# EAGLE design SensorMux_v1.0 (EAGLE 8.6.3)

## Sheet 1 of 6
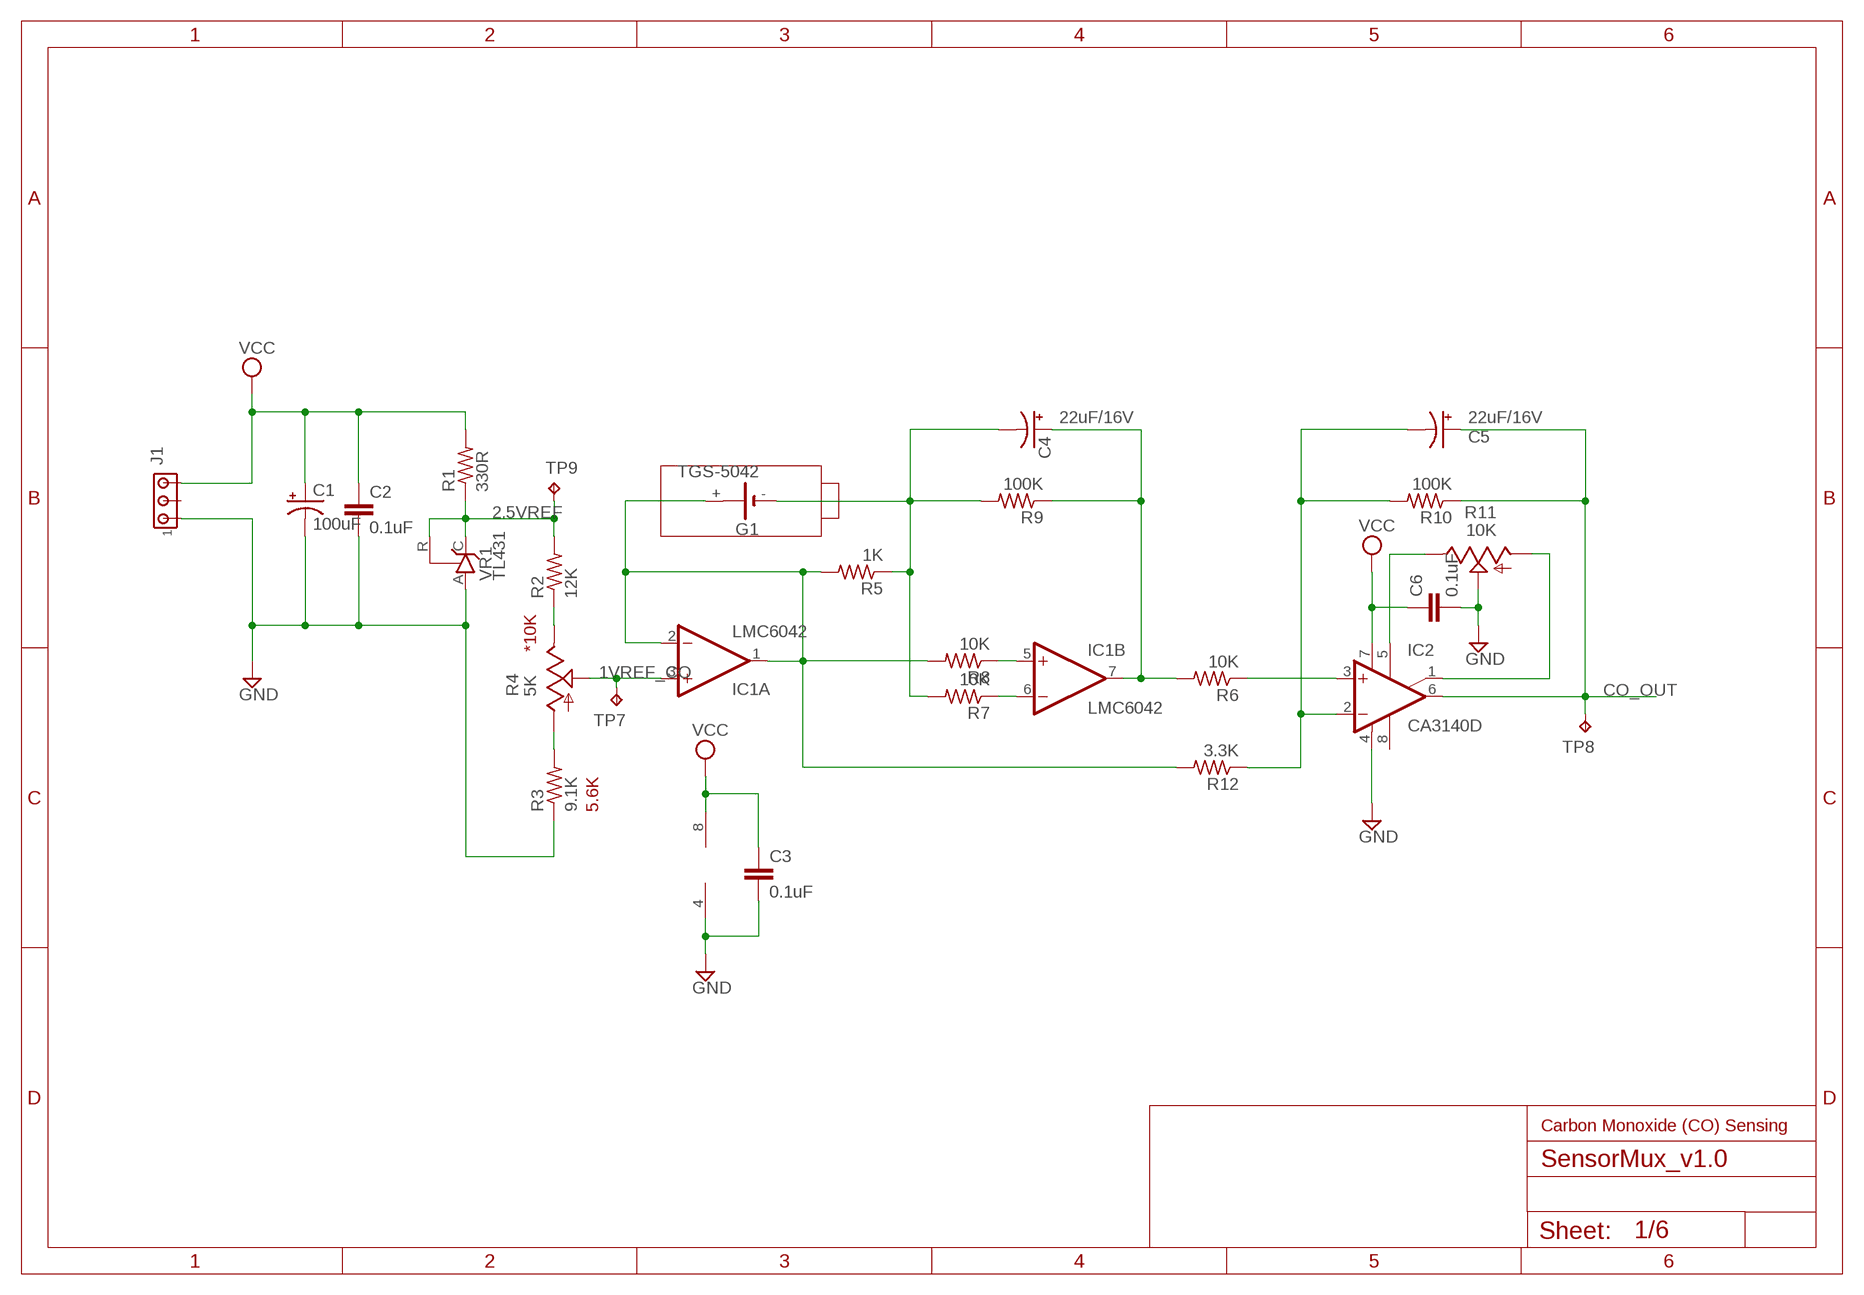
[diagram p0: schematic, sheet 1]

### Parts
C1  100uF  CPOL-USE5-6  [E5-6]
C2  0.1uF  C-EUC0603K  [C0603K]
C3  0.1uF  C-EUC0603K  [C0603K]
C4  22uF/16V  CPOL-USE2.5-6  [E2,5-6]
C5  22uF/16V  CPOL-USE2.5-6  [E2,5-6]
C6  0.1uF  C-EUC0603K  [C0603K]
G1  TGS-5042  CR-AA  [CRAA]
IC1  LMC6042  LM358D  [SO08]
IC2  CA3140D  [SO08]
J1  MTA03-100  [10X03MTA]
R1  330R  R-US_R0805  [R0805]
R2  12K  R-US_R0805  [R0805]
R3  9.1K  R-US_R0805  [R0805]
R4  5K  TRIM_US-B64Y  [B64Y]
R5  1K  R-US_R0805  [R0805]
R6  10K  R-US_R0805  [R0805]
R7  10K  R-US_R0805  [R0805]
R8  10K  R-US_R0805  [R0805]
R9  100K  R-US_R0805  [R0805]
R10  100K  R-US_R0805  [R0805]
R11  10K  TRIM_US-B64Y  [B64Y]
R12  3.3K  R-US_R0805  [R0805]
TP7  1V  TPTP08R  [TP08R]
TP8  CO  TPTP08R  [TP08R]
TP9  2.5V  TPTP08R  [TP08R]
VR1  TL431  TL431CLP  [TO92-CLP]

### Nets
1VREF_CO: IC1.3(A:+IN) R4.S TP7.TP
2.5VREF: R1.1 R2.2 TP9.TP VR1.C VR1.R ; also sheet 3,4
CO_OUT: C5.+ IC2.6(OUT) R10.1 TP8.TP ; also sheet 6
GND: C1.- C2.2 C3.2 C6.2 IC1.4(P:V-) IC2.4(V-) J1.1 R3.1 R11.S VR1.A ; also sheet 2,3,4,5,6
N$1: G1.+ IC1.1(A:OUT) IC1.2(A:-IN) R5.2 R8.2 R12.2
N$3: IC1.6(B:-IN) R7.1
N$4: C4.- G1.- R5.1 R7.2 R9.2
N$6: IC1.5(B:+IN) R8.1
N$9: R2.1 R4.E
N$10: R3.2 R4.A
N$13: C4.+ IC1.7(B:OUT) R6.2 R9.1
N$14: IC2.3(+IN) R6.1
N$15: C5.- IC2.2(-IN) R10.2 R12.1
N$18: IC2.5(ON) R11.E
N$19: IC2.1(ON/CMP) R11.A
VCC: C1.+ C2.1 C3.1 C6.1 IC1.8(P:V+) IC2.7(V+) J1.3 R1.2 ; also sheet 2,3,4,5,6
Unconnected: G1.+@1(+) IC2.8(CMP) J1.2

### Notes on the sheet
- *10K
- 5.6K
- Carbon Monoxide (CO) Sensing

## Sheet 2 of 6
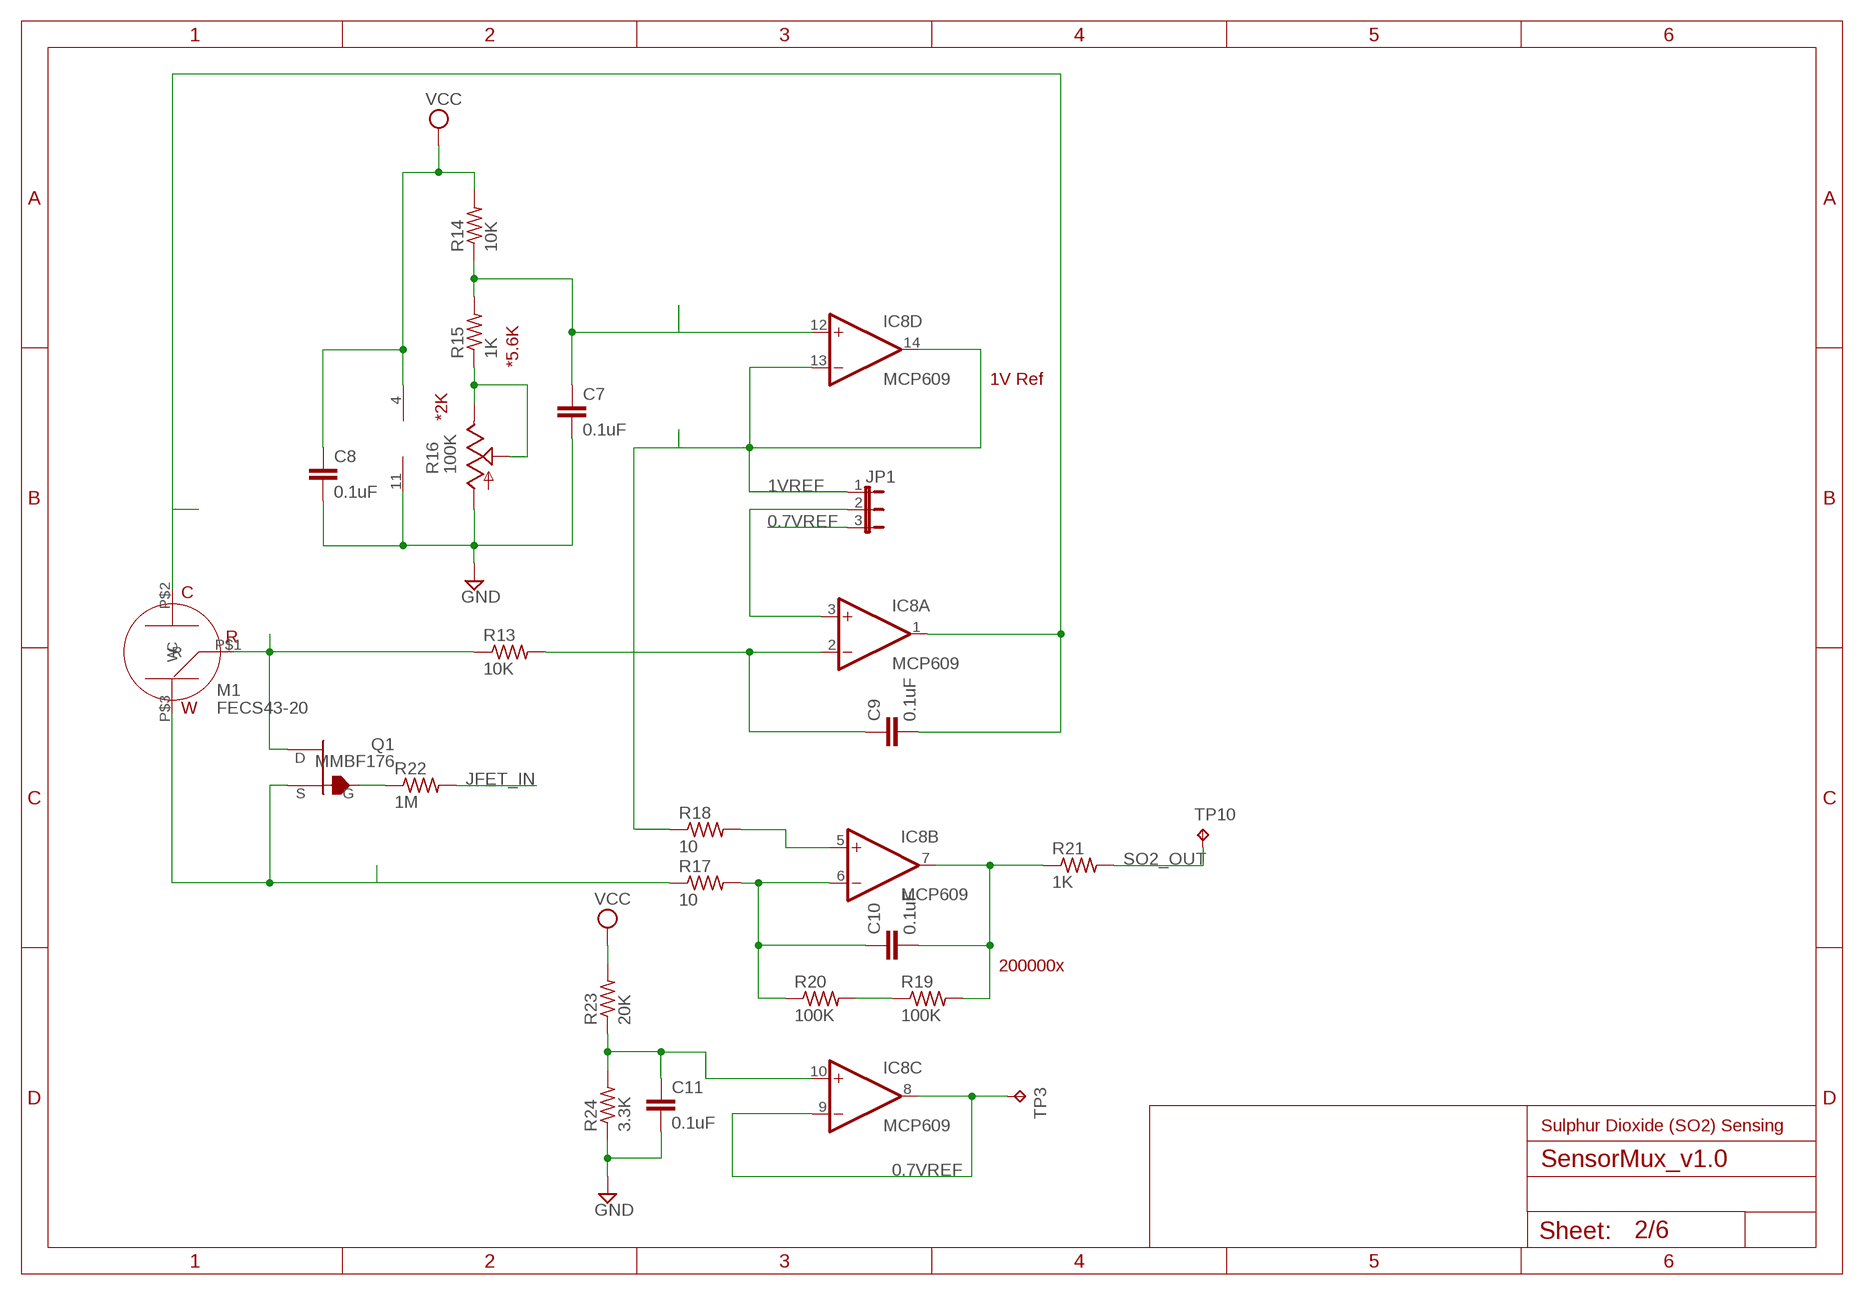
[diagram p1: schematic, sheet 2]

### Parts
C7  0.1uF  C-EUC0603K  [C0603K]
C8  0.1uF  C-EUC0603K  [C0603K]
C9  0.1uF  C-EUC0603K  [C0603K]
C10  0.1uF  C-EUC0603K  [C0603K]
C11  0.1uF  C-EUC0603K  [C0603K]
IC8  MCP609  LM324D  [SO14]
JP1  JP2E  [JP2]
M1  FECS43-20  FECS43  [FECS43]
Q1  MMBF176  SST204  [SOT23]
R13  10K  R-US_R0603  [R0603]
R14  10K  R-US_R0805  [R0805]
R15  1K  R-US_R0805  [R0805]
R16  100K  TRIM_US-B64Y  [B64Y]
R17  10  R-US_R0603  [R0603]
R18  10  R-US_R0603  [R0603]
R19  100K  R-US_R0603  [R0603]
R20  100K  R-US_R0603  [R0603]
R21  1K  R-US_R0603  [R0603]
R22  1M  R-US_R0603  [R0603]
R23  20K  R-US_R0805  [R0805]
R24  3.3K  R-US_R0805  [R0805]
TP3  0.7V  TPTP08R  [TP08R]
TP10  SO2  TPTP08R  [TP08R]

### Nets
0.7V: C11.1 IC8.10(C:+IN) R23.1 R24.2
0.7VREF: IC8.8(C:OUT) IC8.9(C:-IN) JP1.3 TP3.TP
1VREF: IC8.13(D:-IN) IC8.14(D:OUT) JP1.1 R18.1
GND: C7.2 C8.2 C11.2 IC8.11(P:V-) R16.A R24.1 ; also sheet 1,3,4,5,6
JFET_IN: R22.2 ; also sheet 6
N$2: C9.1 IC8.2(A:-IN) R13.2
N$7: M1.P$1(R) Q1.1(D) R13.1
N$8: C9.2 IC8.1(A:OUT) M1.P$2(C)
N$11: R15.1 R16.E R16.S
N$16: R19.1 R20.2
N$17: C7.1 IC8.12(D:+IN) R14.1 R15.2
N$20: IC8.3(A:+IN) JP1.2
N$21: C10.1 IC8.6(B:-IN) R17.2 R20.1
N$22: IC8.5(B:+IN) R18.2
N$23: M1.P$3(W) Q1.2(S) R17.1
N$26: C10.2 IC8.7(B:OUT) R19.2 R21.1
N$27: Q1.3(G) R22.1
SO2_OUT: R21.2 TP10.TP ; also sheet 6
VCC: C8.1 IC8.4(P:V+) R14.2 R23.2 ; also sheet 1,3,4,5,6

### Notes on the sheet
- *5.6K
- 1V Ref
- *2K
- 200000x
- Sulphur Dioxide (SO2) Sensing

## Sheet 3 of 6
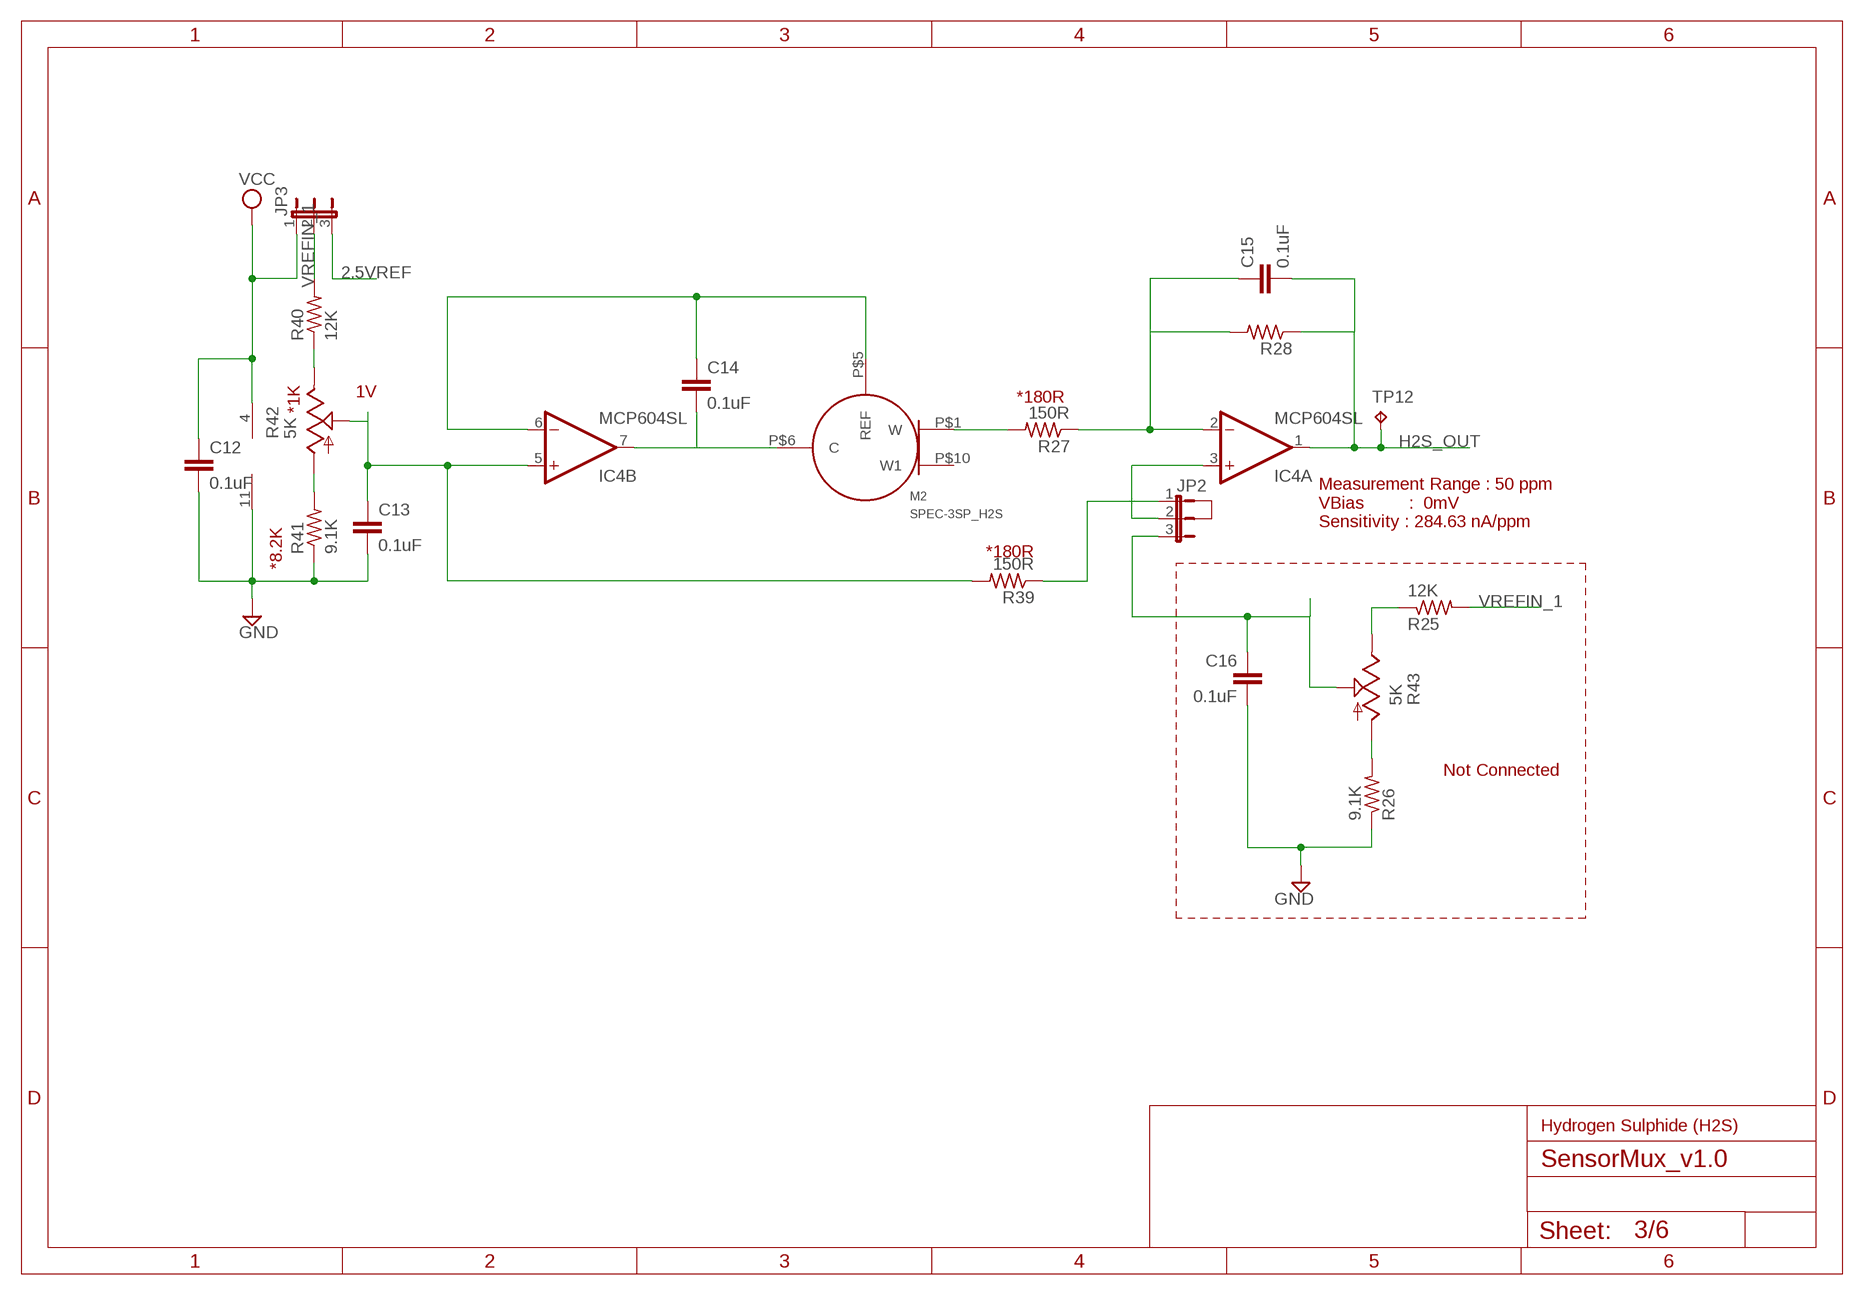
[diagram p2: schematic, sheet 3]

### Parts
C12  0.1uF  C-EUC0603K  [C0603K]
C13  0.1uF  C-EUC0603K  [C0603K]
C14  0.1uF  C-EUC0603K  [C0603K]
C15  0.1uF  C-EUC0603K  [C0603K]
C16  0.1uF  C-EUC0603K  [C0603K]
IC4  MCP604SL  [SO14]
JP2  JP2E  [JP2]
JP3  JP2E  [JP2]
M2  SPEC-3SP_H2S  SPEC-3SP  [SPEC-3SP]
R25  12K  R-US_R0805  [R0805]
R26  9.1K  R-US_R0805  [R0805]
R27  150R  R-US_R0805  [R0805]
R28  R-US_R0805  [R0805]
R39  150R  R-US_R0805  [R0805]
R40  12K  R-US_R0805  [R0805]
R41  9.1K  R-US_R0805  [R0805]
R42  5K  TRIM_US-B64Y  [B64Y]
R43  5K  TRIM_US-B64Y  [B64Y]
TP12  H2S  TPTP08R  [TP08R]

### Nets
2.5VREF: JP3.3 ; also sheet 1,4
GND: C12.2 C13.2 C16.2 IC4.11(P:V-) R26.1 R41.1 ; also sheet 1,2,4,5,6
H2S_OUT: C15.2 IC4.1(A:OUT) R28.1 TP12.TP ; also sheet 6
N$24: C14.1 IC4.6(B:-IN) M2.P$5(REF)
N$25: C14.2 IC4.7(B:OUT) M2.P$6(C)
N$28: C13.1 IC4.5(B:+IN) R39.2 R42.S
N$29: M2.P$1(W) R27.2
N$30: C15.1 IC4.2(A:-IN) R27.1 R28.2
N$33: C16.1 JP2.3 R43.S
N$37: IC4.3(A:+IN) JP2.2
N$38: R25.1 R43.E
N$39: R26.2 R43.A
N$40: JP2.1 R39.1
N$41: R40.1 R42.E
N$42: R41.2 R42.A
VCC: C12.1 IC4.4(P:V+) JP3.1 ; also sheet 1,2,4,5,6
VREFIN_1: JP3.2 R25.2 R40.2
Unconnected: M2.P$2 M2.P$3 M2.P$4 M2.P$7 M2.P$8 M2.P$9 M2.P$10(W1)

### Notes on the sheet
- *1K | 1V
- *180R
- *8.2K
- Measurement Range : 50 ppm
  VBias         :  0mV
  Sensitivity : 284.63 nA/ppm
- *180R
- Not Connected
- Hydrogen Sulphide (H2S)

## Sheet 4 of 6
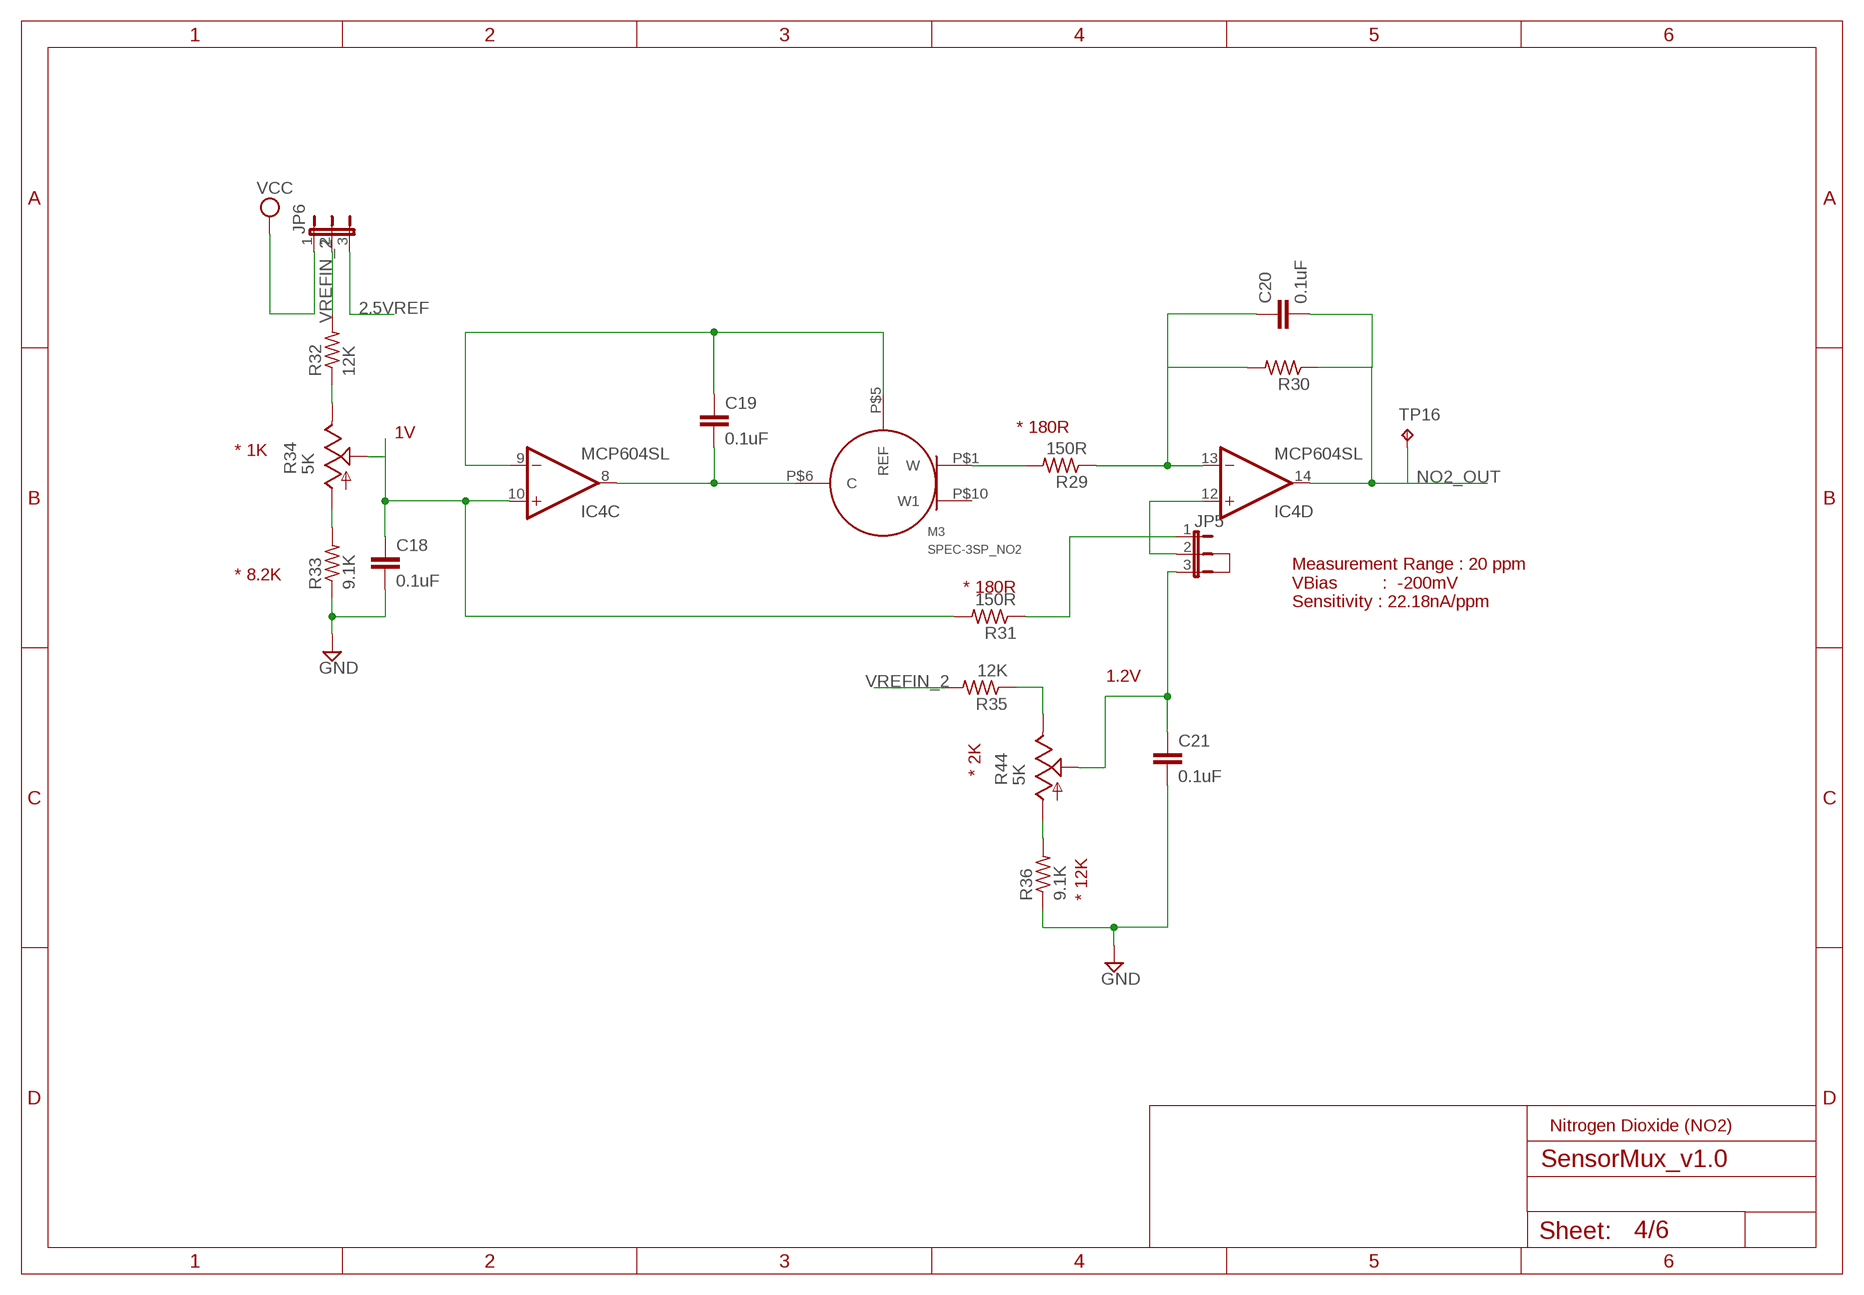
[diagram p3: schematic, sheet 4]

### Parts
C18  0.1uF  C-EUC0603K  [C0603K]
C19  0.1uF  C-EUC0603K  [C0603K]
C20  0.1uF  C-EUC0603K  [C0603K]
C21  0.1uF  C-EUC0603K  [C0603K]
JP5  JP2E  [JP2]
JP6  JP2E  [JP2]
M3  SPEC-3SP_NO2  SPEC-3SP  [SPEC-3SP]
R29  150R  R-US_R0805  [R0805]
R30  R-US_R0805  [R0805]
R31  150R  R-US_R0805  [R0805]
R32  12K  R-US_R0805  [R0805]
R33  9.1K  R-US_R0805  [R0805]
R34  5K  TRIM_US-B64Y  [B64Y]
R35  12K  R-US_R0805  [R0805]
R36  9.1K  R-US_R0805  [R0805]
R44  5K  TRIM_US-B64Y  [B64Y]
TP16  NO2  TPTP08R  [TP08R]

### Nets
2.5VREF: JP6.3 ; also sheet 1,3
GND: C18.2 C21.2 R33.1 R36.1 ; also sheet 1,2,3,5,6
N$5: C19.1 IC4.9(C:-IN) M3.P$5(REF)
N$31: C19.2 IC4.8(C:OUT) M3.P$6(C)
N$32: C18.1 IC4.10(C:+IN) R31.2 R34.S
N$34: M3.P$1(W) R29.2
N$35: C20.1 IC4.13(D:-IN) R29.1 R30.2
N$36: C21.1 JP5.3 R44.S
N$43: IC4.12(D:+IN) JP5.2
N$46: JP5.1 R31.1
N$47: R32.1 R34.E
N$48: R33.2 R34.A
N$49: R35.1 R44.E
N$50: R36.2 R44.A
NO2_OUT: C20.2 IC4.14(D:OUT) R30.1 TP16.TP ; also sheet 6
VCC: JP6.1 ; also sheet 1,2,3,5,6
VREFIN_2: JP6.2 R32.2 R35.2
Unconnected: M3.P$2 M3.P$3 M3.P$4 M3.P$7 M3.P$8 M3.P$9 M3.P$10(W1)

### Notes on the sheet
- * 180R
- 1V
- * 1K
- * 8.2K | * 180R
- Measurement Range : 20 ppm
  VBias         :  -200mV
  Sensitivity : 22.18nA/ppm
- 1.2V
- * 2K
- * 12K
- Nitrogen Dioxide (NO2)

## Sheet 5 of 6
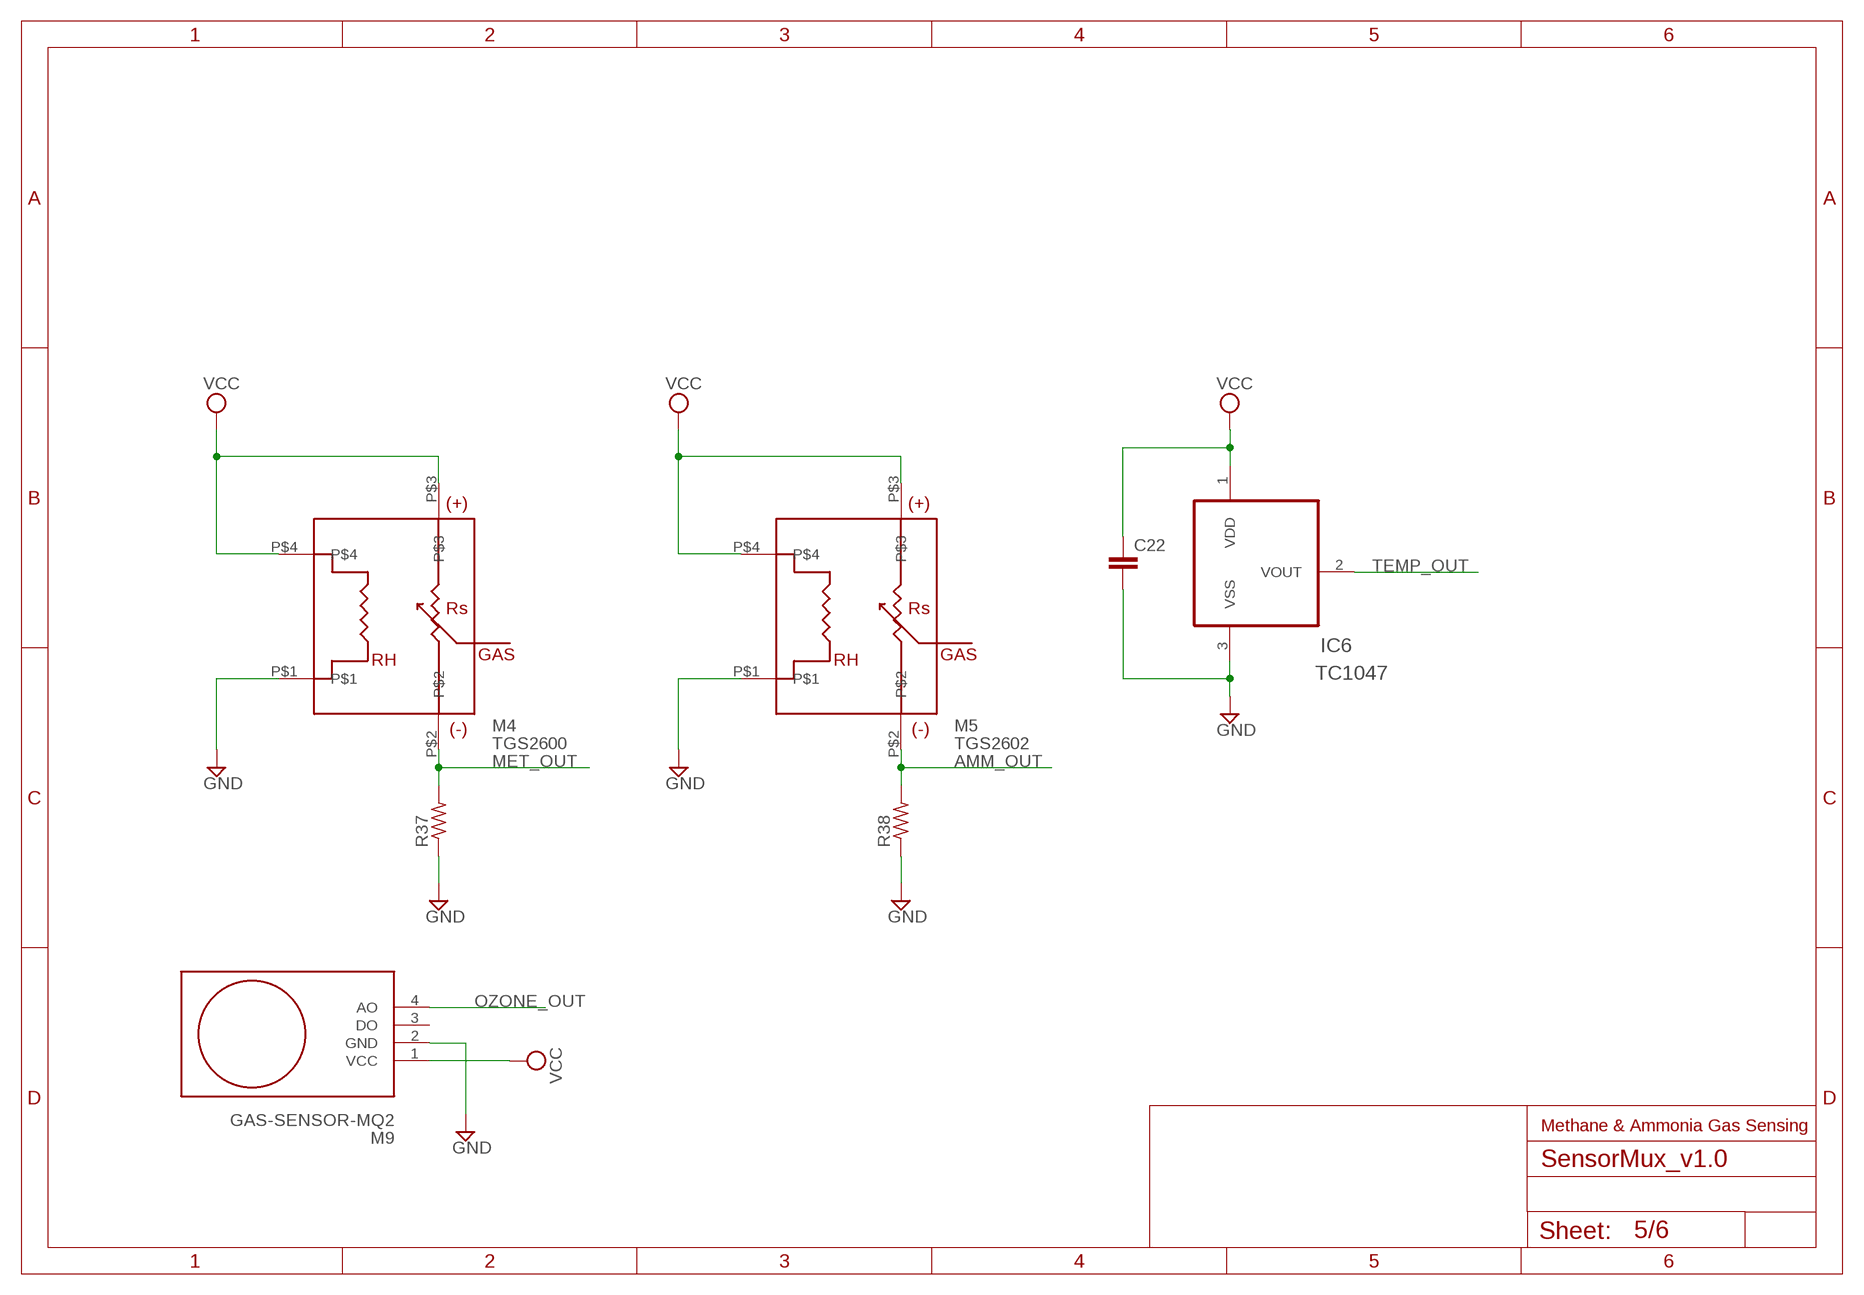
[diagram p4: schematic, sheet 5]

### Parts
C22  C-EUC0603K  [C0603K]
IC6  TC1047  TC1047AVNBTR  [SOT95P237X112-3N]
M4  TGS2600  TGS26XX  [TGS26XX]
M5  TGS2602  TGS26XX  [TGS26XX]
M9  GAS-SENSOR-MQ2  [GAS-SENSOR-MQ2]
R37  R-US_M0805  [M0805]
R38  R-US_M0805  [M0805]

### Nets
AMM_OUT: M5.P$2 R38.2 ; also sheet 6
GND: C22.2 IC6.3(VSS) M4.P$1 M5.P$1 M9.2(GND) R37.1 R38.1 ; also sheet 1,2,3,4,6
MET_OUT: M4.P$2 R37.2 ; also sheet 6
OZONE_OUT: M9.4(AO) ; also sheet 6
TEMP_OUT: IC6.2(VOUT) ; also sheet 6
VCC: C22.1 IC6.1(VDD) M4.P$3 M4.P$4 M5.P$3 M5.P$4 M9.1(VCC) ; also sheet 1,2,3,4,6
Unconnected: M9.3(DO)

### Notes on the sheet
- Methane & Ammonia Gas Sensing

## Sheet 6 of 6
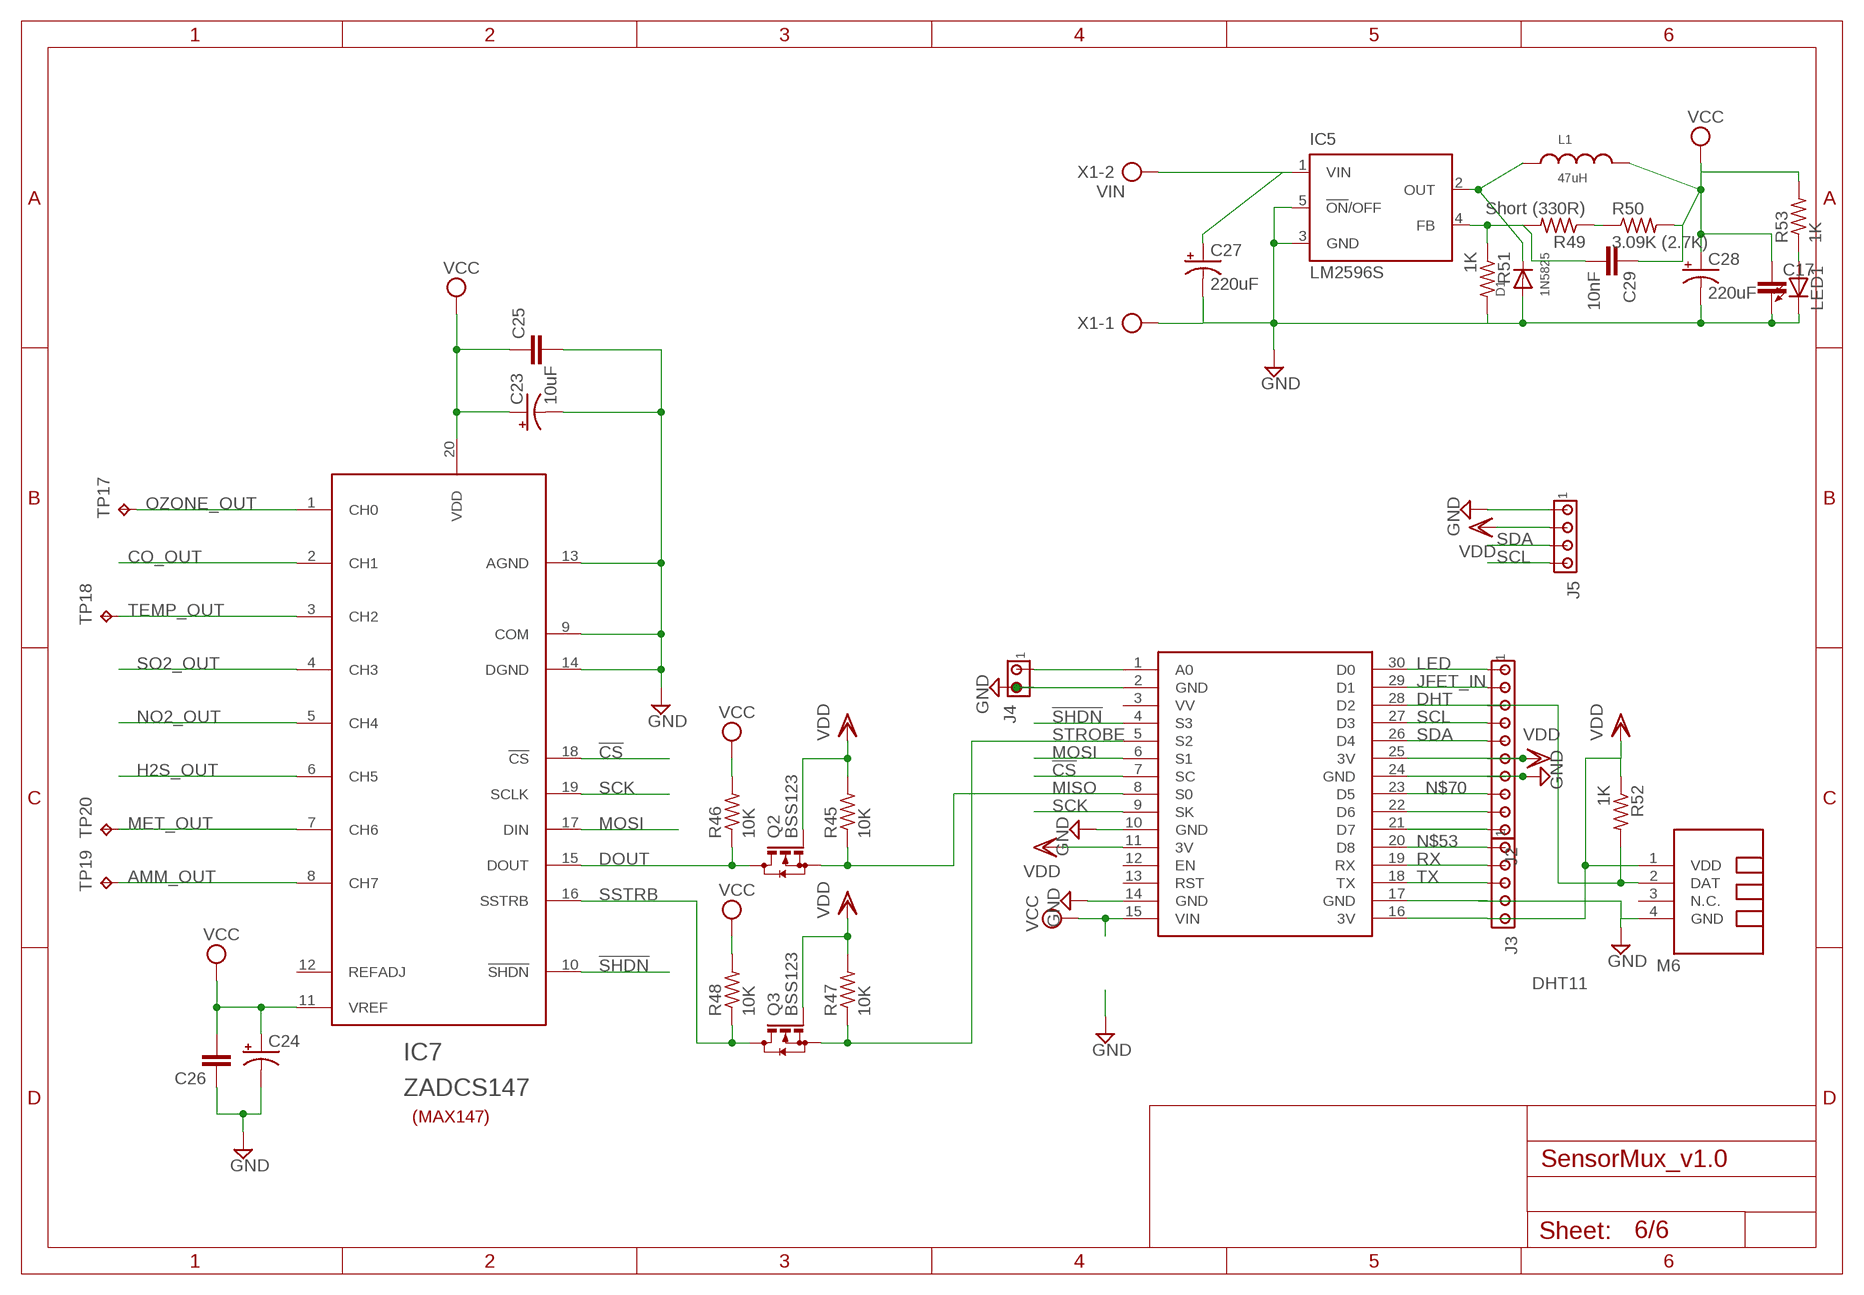
[diagram p5: schematic, sheet 6]

### Parts
C17  C-EUC0603K  [C0603K]
C23  10uF  CPOL-USSMCA  [SMC_A]
C24  CPOL-USSMCA  [SMC_A]
C25  C-EUC0603K  [C0603K]
C26  C-EUC0603K  [C0603K]
C27  220uF  CPOL-US140CLH-0810  [140CLH-0810]
C28  220uF  CPOL-US140CLH-0810  [140CLH-0810]
C29  10nF  C-EUC0603K  [C0603K]
D1  1N5825  DIODESMA  [SMADIODE]
IC5  LM2596S  [TO263-5]
IC7  ZADCS147  [SSOP20]
J2  MTA10-100  [10X10MTA]
J3  MTA05-100  [10X05MTA]
J4  MTA02-100  [10X02MTA]
J5  MTA04-100  [10X04MTA]
L1  47uH  WE-CHSA_1212_7843320039  [WE-CHSA_1212]
LED1  LED3MM  [LED3MM]
M6  DHT11  TEMP-HUM-SENSOR-DHT11  [TEMP-HUM-SENSOR-DHT11]
M8  NODEMCU  [NODEMCU]
Q2  BSS123  [SOT23]
Q3  BSS123  [SOT23]
R45  10K  R-US_R0603  [R0603]
R46  10K  R-US_R0603  [R0603]
R47  10K  R-US_R0603  [R0603]
R48  10K  R-US_R0603  [R0603]
R49  Short (330R)  R-US_R0603  [R0603]
R50  3.09K (2.7K)  R-US_R0603  [R0603]
R51  1K  R-US_R0603  [R0603]
R52  1K  R-US_R0603  [R0603]
R53  1K  R-US_R0603  [R0603]
TP17  Ozone  TPTP08R  [TP08R]
TP18  Temp  TPTP08R  [TP08R]
TP19  AMM  TPTP08R  [TP08R]
TP20  MET  TPTP08R  [TP08R]
X1  VIN  AK500/2  [AK500/2]

### Nets
!CS: IC7.18(!CS) M8.7(SC)
!SHDN: IC7.10(!SHDN) M8.4(S3)
AMM_OUT: IC7.8(CH7) TP19.TP ; also sheet 5
CO_OUT: IC7.2(CH1) ; also sheet 1
DHT: J2.3 M6.2(DAT) M8.28(D2) R52.2
DOUT: IC7.15(DOUT) Q2.3(D) R46.1
GND: C17.2 C23.- C24.- C25.2 C26.1 C27.- C28.- D1.A IC5.3(GND) IC5.5(!ON!/OFF) IC7.9(COM) IC7.13(AGND) IC7.14(DGND) J2.7 J4.2 J5.1 LED1.K(C) M6.4(GND) M8.2(GND) M8.10(GND) M8.14(GND) M8.24(GND) R51.2 X1.1 ; also sheet 1,2,3,4,5
H2S_OUT: IC7.6(CH5) ; also sheet 3
JFET_IN: J2.2 M8.29(D1) ; also sheet 2
LED: J2.1 M8.30(D0)
MET_OUT: IC7.7(CH6) TP20.TP ; also sheet 5
MISO: M8.8(S0) Q2.2(S) R45.1
MOSI: IC7.17(DIN) M8.6(S1)
N$53: J3.1 M8.20(D8)
N$57: LED1.A R53.1
N$59: R49.1 R50.1
N$70: J2.8 M8.23(D5)
N$71: J2.9 M8.22(D6)
N$72: J2.10 M8.21(D7)
N$76: J3.4 M8.17(GND)
N$78: J4.1 M8.1(A0)
NO2_OUT: IC7.5(CH4) ; also sheet 4
OUT: D1.C IC5.2(OUT) L1.1
OZONE_OUT: IC7.1(CH0) TP17.TP ; also sheet 5
RX: J3.2 M8.19(RX)
SCK: IC7.19(SCLK) M8.9(SK)
SCL: J2.4 J5.4 M8.27(D3)
SDA: J2.5 J5.3 M8.26(D4)
SO2_OUT: IC7.4(CH3) ; also sheet 2
SSTRB: IC7.16(SSTRB) Q3.3(D) R48.1
STROBE: M8.5(S2) Q3.2(S) R47.1
TEMP_OUT: IC7.3(CH2) TP18.TP ; also sheet 5
TX: J3.3 M8.18(TX)
VCC: C17.1 C23.+ C24.+ C25.1 C26.2 C28.+ C29.1 IC7.11(VREF) IC7.20(VDD) L1.2 M8.15(VIN) R46.2 R48.2 R50.2 R53.2 ; also sheet 1,2,3,4,5
VDD: J2.6 J3.5 J5.2 M6.1(VDD) M8.11(3V) M8.16(3V) M8.25(3V) Q2.1(G) Q3.1(G) R45.2 R47.2 R52.1
VFBK: C29.2 IC5.4(FB) R49.2 R51.1
VIN: C27.+ IC5.1(VIN) X1.2
Unconnected: IC7.12(REFADJ) M6.3(N.C.) M8.3(VV) M8.12(EN) M8.13(RST)

### Notes on the sheet
- (MAX147)

## Library data of the parts
C1 C4 C5 C23 C24 C27 C28 = rcl:CPOL-US: POLARIZED CAPACITOR, American symbol; SPICEPREFIX: C
C2 C3 C6 = resistor:C-EU: CAPACITOR, European symbol
C7-C22 C25 C26 C29 = rcl:C-EU: CAPACITOR, European symbol; SPICEPREFIX: C
D1 = adafruit:DIODE: Diode SMADIODE - SMA Surface Mount Package 20V 1A Schottky Diode Digikey: 641-1014-6-ND DO-1N4148 - Through Hole Small Current Diode SOD-123 20V 1 A (.5mV Vf) Schottky Diode - Digikey: MBRX120TPMSCT-ND SOD-323 10V 570mA (.38mV Vf, 3ns) Schottky Diode - Digikey: ZLLS410CT-ND SOD-523 30V 30mA Schottky Diode (RB751S-40TE61) - Digikey: RB751S-40TE61CT-ND SOT23-R/W - SOT23 Package (R = Solder Paste/Reflow Ovens, W = Hand-Soldering) BAT54Film 40V 300mA - Digikey: 497-7162-1-ND
G1 = battery:CR-AA: LI BATTERY Varta CRAA-SLF
IC1 = linear:LM358: OP AMP also LM158; LM258; LM2904 Source: http://cache.national.com/ds/LM/LM158.pdf
IC2 = linear:CA3140: OP AMP
IC4 = linear:MCP604: Quad Op Amp 2.7V to 6.0V Single Supply CMOS Source: http://ww1.microchip.com/downloads/en/DeviceDoc/21314g.pdf
IC5 = national-semiconductor:LM2596: SIMPLE SWITCHER® Power Converter 150 kHz 3A Step-Down Voltage Regulator Source: http://www.national.com/ds/LM/LM2596.pdf; MF: NATIONAL SEMICONDUCTOR; MPN: LM2596S-ADJ/NOPB; OC_FARNELL: 9494367; OC_NEWARK: 41K3842
IC6 = GEOES:TC1047AVNBTR: IC, TEMP TO VOLT CONVTR, SMD, 1047,SOT-23B, 3-lead; MPN: TC1047AVNBTR; OC_FARNELL: 9762531; OC_NEWARK: 89C8093; PACKAGE: SOT-23B, 3-lead; SUPPLIER: Microchip
IC7 = GEOES:ZADCS147: ZMDI ZADCS146 / ZADCS147 8 channel, 200Ksps, 12-bit - SAR ADC
IC8 = linear:LM324: OP AMP
J1 = con-amp:MTA03-100: AMP connector
J2 = con-amp:MTA10-100: AMP connector
J3 = con-amp:MTA05-100: AMP connector
J4 = con-amp:MTA02-100: AMP connector
J5 = con-amp:MTA04-100: AMP connector
JP1-JP3 JP5 JP6 = jumper:JP2E: JUMPER
L1 = EMCComponents (rev19c):WE-CHSA_1212: WE-CHSA SMD High Current Inductor Characteristics Magnetically shielded rod- core inductor Operating temperature: -55°C to +150°C Current capability up to 28A Ideal coplanarity due to embedded solder pads Applications HFilter choke for motor electronics Car infotainment Multimedia applications <http://katalog.we-online.de/media/images/v2/Family_WE-CHSA_78433xxxx_Gruppe_4C.jpg> Details see: http://katalog.we-online.de/en/pbs/WE-CHSA Created by Yingchun,Shan 2017-12-06 2017 (C) Wurth Elektronik; WE-NUMBER: 7843320039/0,39uH
LED1 = led:LED: LED OSRAM: - CHIPLED LG R971, LG N971, LY N971, LG Q971, LY Q971, LO R971, LY R971 LH N974, LH R974 LS Q976, LO Q976, LY Q976 LO Q996 - Hyper CHIPLED LW Q18S LB Q993, LB Q99A, LB R99A - SideLED LS A670, LO A670, LY A670, LG A670, LP A670 LB A673, LV A673, LT A673, LW A673 LH A674 LY A675 LS A676, LA A676, LO A676, LY A676, LW A676 LS A679, LY A679, LG A679 - Hyper Micro SIDELED® LS Y876, LA Y876, LO Y876, LY Y876 LT Y87S - SmartLED LW L88C, LW L88S LB L89C, LB L89S, LG L890 LS L89K, LO L89K, LY L89K LS L896, LA L896, LO L896, LY L896 - TOPLED LS T670, LO T670, LY T670, LG T670, LP T670 LSG T670, LSP T670, LSY T670, LOP T670, LYG T670 LG T671, LOG T671, LSG T671 LB T673, LV T673, LT T673, LW T673 LH T674 LS T676, LA T676, LO T676, LY T676, LB T676, LH T676, LSB T676, LW T676 LB T67C, LV T67C, LT T67C, LS T67K, LO T67K, LY T67K, LW E67C LS E67B, LA E67B, LO E67B, LY E67B, LB E67C, LV E67C, LT E67C LW T67C LS T679, LY T679, LG T679 LS T770, LO T770, LY T770, LG T770, LP T770 LB T773, LV T773, LT T773, LW T773 LH T774 LS E675, LA E675, LY E675, LS T675 LS T776, LA T776, LO T776, LY T776, LB T776 LHGB T686 LT T68C, LB T68C - Hyper Mini TOPLED® LB M676 - Mini TOPLED Santana® LG M470 LS M47K, LO M47K, LY M47K Source: http://www.osram.convergy.de LUXEON: - LUMILED® LXK2-PW12-R00, LXK2-PW12-S00, LXK2-PW14-U00, LXK2-PW14-V00 LXK2-PM12-R00, LXK2-PM12-S00, LXK2-PM14-U00 LXK2-PE12-Q00, LXK2-PE12-R00, LXK2-PE12-S00, LXK2-PE14-T00, LXK2-PE14-U00 LXK2-PB12-K00, LXK2-PB12-L00, LXK2-PB12-M00, LXK2-PB14-N00, LXK2-PB14-P00, LXK2-PB14-Q00 LXK2-PR12-L00, LXK2-PR12-M00, LXK2-PR14-Q00, LXK2-PR14-R00 LXK2-PD12-Q00, LXK2-PD12-R00, LXK2-PD12-S00 LXK2-PH12-R00, LXK2-PH12-S00 LXK2-PL12-P00, LXK2-PL12-Q00, LXK2-PL12-R00 Source: www.luxeon.com KINGBRIGHT: KA-3528ASYC Source: www.kingbright.com
M1 = GEOES:FECS43: Figaro FECS43 FECS43-20 - for the Detection of Sulfur Dioxide (SO2)
M2 M3 = GEOES:SPEC-3SP: SPEC 3SP H2S Sensor 50 ppm Package 110-304
M4 M5 = GEOES:TGS26XX: Figaro TGS26xx Sensors TGS 2600 - for the detection of Air Contaminants hydrogen, ethanol,Iso butane etc. TGS 2602 - for the detection of Air Contaminants VOCs, ammonia, Ethanol, H2S, etc. TGS 2611 - for the detection of Methane
M6 = diy-modules:TEMP-HUM-SENSOR-DHT11: DHT11 - digital humidity & temperature sensor DHT11 datasheet available here: https://akizukidenshi.com/download/ds/aosong/DHT11.pdf Click here to find device on ebay.com <http://www.ebay.com/sch/dht11+digital+sensor>
M8 = nodemcu:NODEMCU
M9 = diy-modules:GAS-SENSOR-MQ2: Gas Sensor based on MQ-2 device Guide describing how to use MQ-2 sensor with Arduino is available here: http://www.instructables.com/id/How-to-use-MQ2-Gas-Sensor-Arduino-Tutorial/ MQ-2 sensor datasheet is available here: http://gas-sensor.ru/pdf/combustible-gas-sensor.pdf Click here to find device on ebay.com <http://www.ebay.com/sch/mq2+sensor+module+smoke>
Q1 = transistor-fet:?20*: TEMIC / Siliconix N-Channel JFET Source: JFET-J201_Siliconix_data.pdf
Q2 Q3 = transistor-small-signal:BSS123: N-CHANNEL MOS FET
R1-R3 R5-R10 R12-R15 R17-R33 R35-R41 R45-R53 = resistor:R-US_: RESISTOR, American symbol
R4 R11 R16 R34 R42-R44 = pot:TRIM_US-: POTENTIOMETER
TP3 TP7-TP10 TP12 TP16-TP20 = testpad:TP: Test pad
VR1 = v-reg:TL431CLP: VOLTAGE REGULATOR
X1 = con-ptr500:AK500/2: CONNECTOR; OC_FARNELL: unknown; OC_NEWARK: unknown

## Board
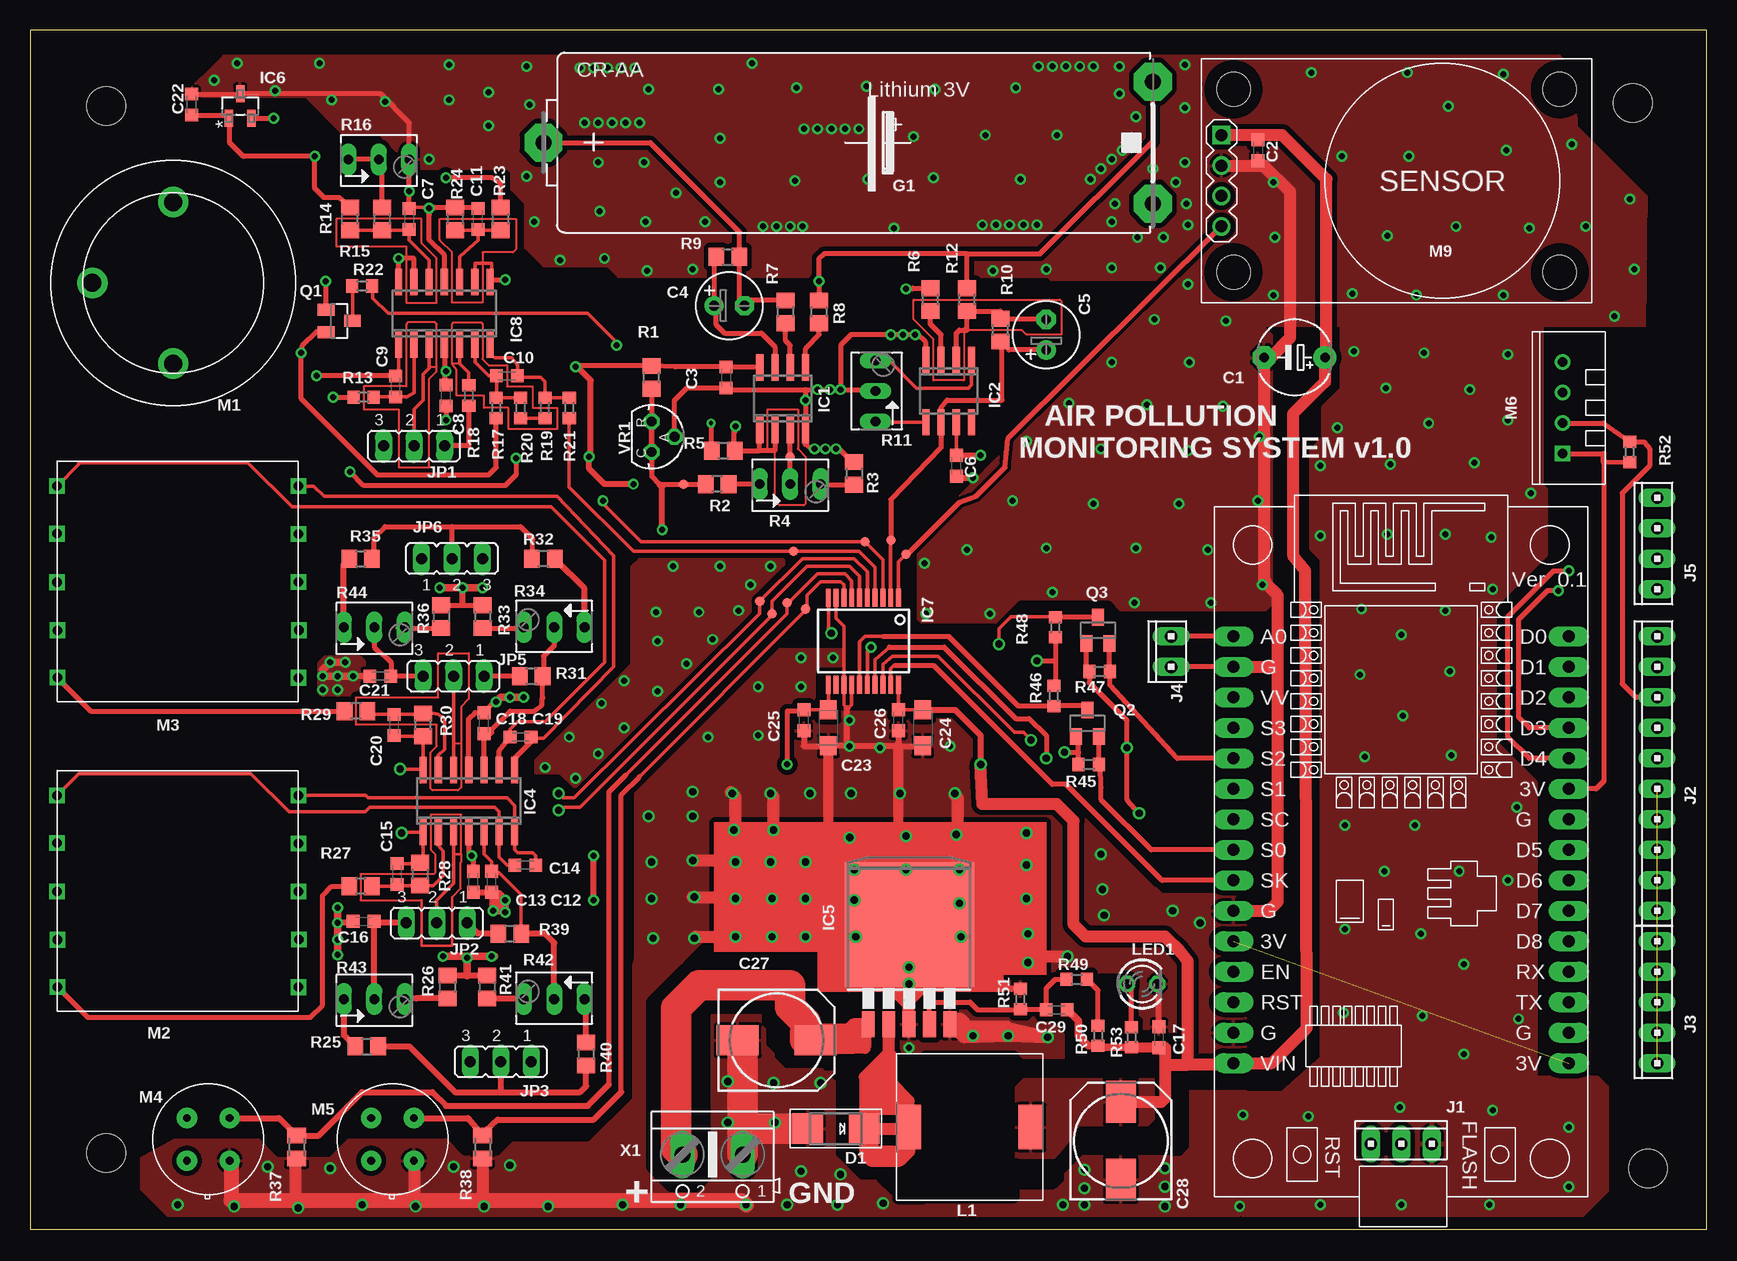
[diagram p6: board, top side]
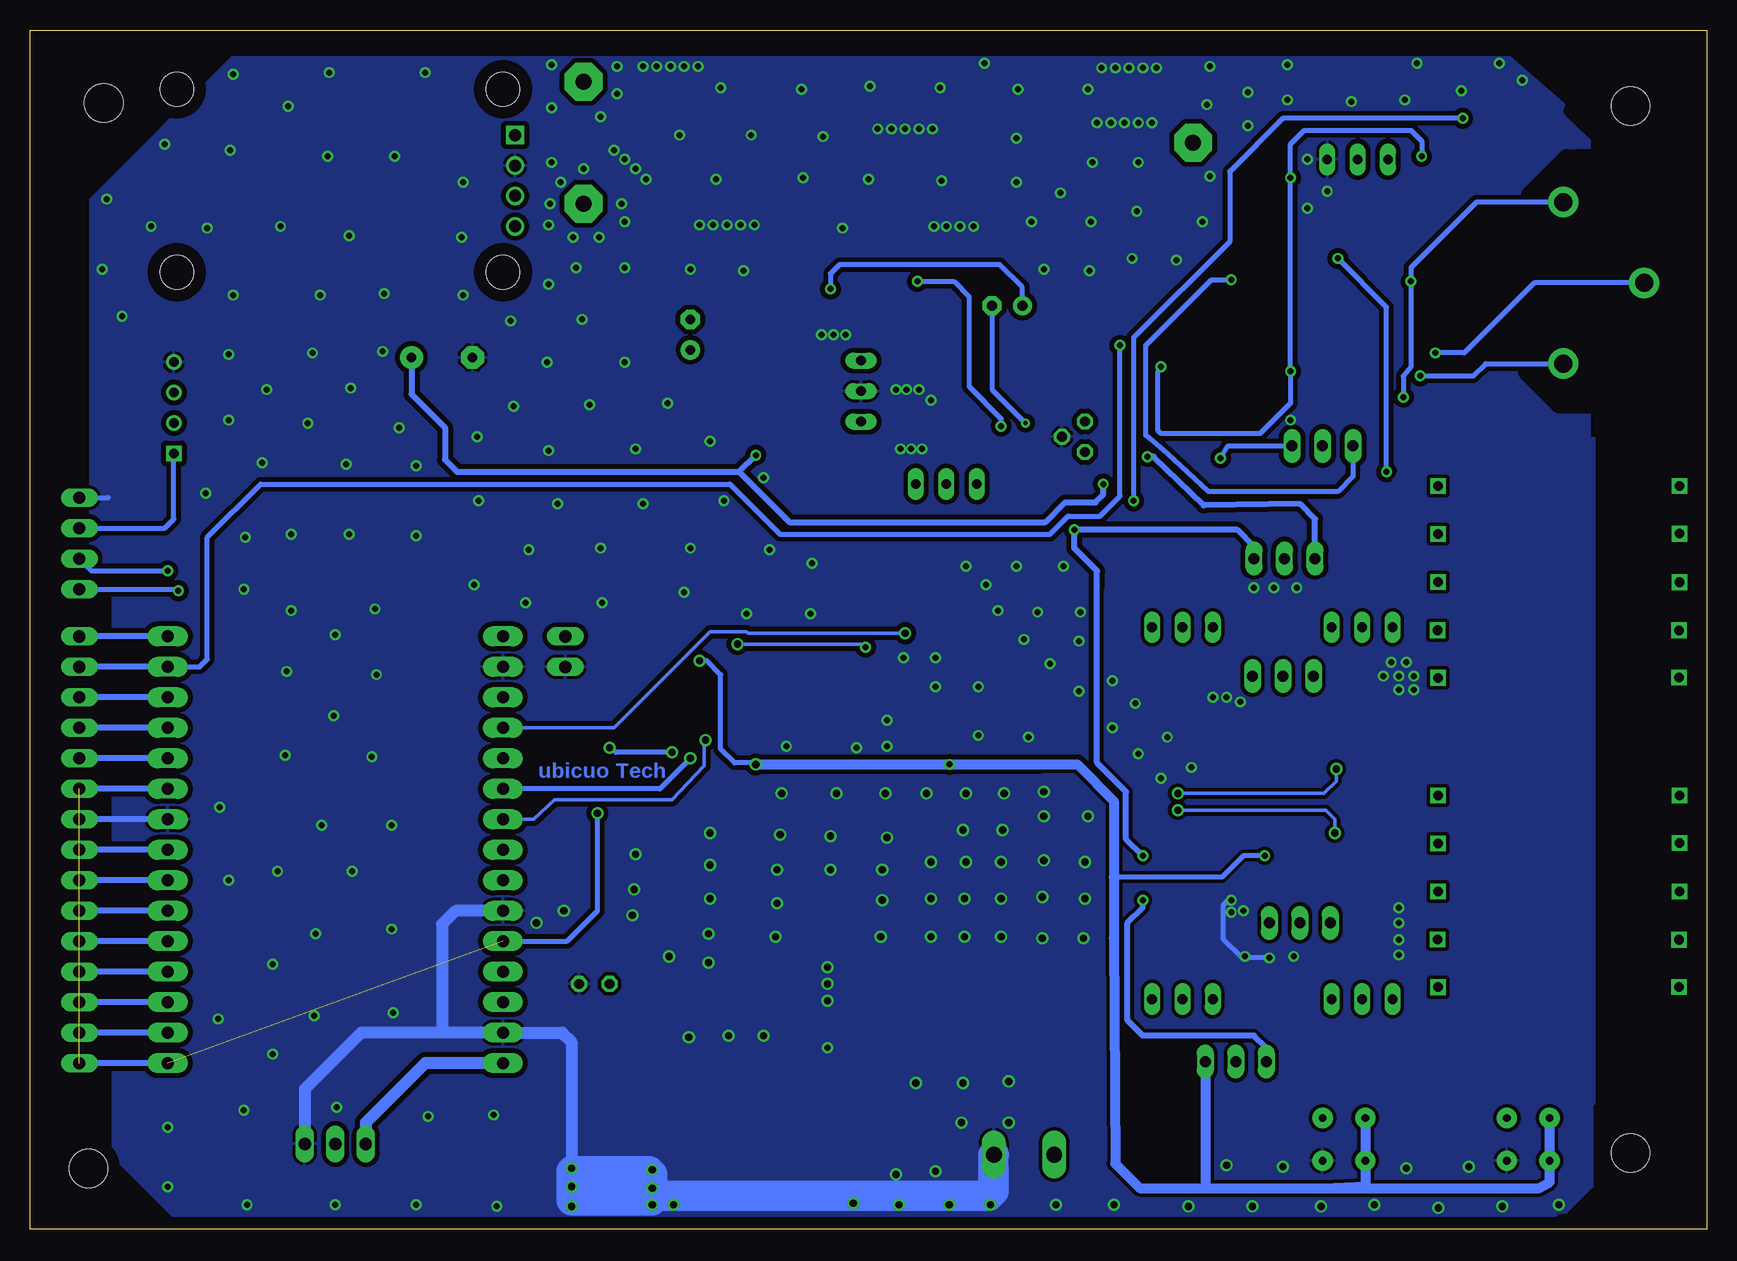
[diagram p7: board, bottom side, seen from below]

Size 139.75 x 99.94 mm. Coordinates in mm from the lower left corner, seen from the top.
Outline: 0,0 139.75,0 139.75,99.94 0,99.94 0,0
Copper layers (1*16): Top 0.035mm / dielectric 1.5mm / Bottom 0.035mm
Design rules "default *": minimum track width 6mil, minimum drill 0.35mm, track to track 12mil, track to pad 6mil, pad to pad 6mil, via to via 6mil, smd to smd 6mil, copper to edge 40mil, drill to drill 6mil, minimum pad ring 10mil, minimum via ring 8mil, stop-mask expansion 4mil, vias tented up to drill 0.6mm, thermal gap 10mil
Holes 3.2 mm at 6.35,6.35 6.35,93.6 133.6,93.85 134.87,5.08
tRestrict: 50 lines
bRestrict: 12 lines

### Footprints (pad centres in the part's own frame; a part is rotated, then mirrored left to right if it is on the bottom)
E5-6 = drill 0.813 pad 1.905: + -2.54,0 | drill 0.813 pad 1.905 octagon: - 2.54,0
C0603K = smd 1.05 x 1.08: 1 -0.875,0; 2 0.875,0
E2,5-6 = drill 0.813 pad 1.6: + -1.27,0 | drill 0.813 pad 1.6 octagon: - 1.27,0
SMC_A = smd 1.6 x 1.4: + -1.5,0; - 1.5,0
140CLH-0810 = smd 3.5 x 2.5: + 3.25,0; - -3.25,0
SMADIODE = smd 2.54 x 2.54: A 2.349,0; C -2.349,0
CRAA = drill 1.321 pad 3.15 octagon: + -25.4,-5.08; +@1 -25.4,5.08; - 25.4,0
SO08 = smd 0.6 x 2.2: 1 -1.905,-2.6; 2 -0.635,-2.6; 3 0.635,-2.6; 4 1.905,-2.6; 5 1.905,2.6; 6 0.635,2.6; 7 -0.635,2.6; 8 -1.905,2.6
SO14 = smd 0.6 x 2.2: 1 -3.81,-2.6; 2 -2.54,-2.6; 3 -1.27,-2.6; 4 0,-2.6; 5 1.27,-2.6; 6 2.54,-2.6; 7 3.81,-2.6; 8 3.81,2.6; 9 2.54,2.6; 10 1.27,2.6; 11 0,2.6; 12 -1.27,2.6; 13 -2.54,2.6; 14 -3.81,2.6
TO263-5 = smd 1.067 x 2.159: 1 -3.404,-5.791; 2 -1.702,-5.791; 3 0,-5.791; 4 1.702,-5.791; 5 3.404,-5.791 | smd 10.8 x 10.41: 6 0,2.54
SOT95P237X112-3N = smd 1.422 x 0.711: 1 -1.016,0.94; 2 -1.016,-0.94; 3 1.016,0
SSOP20 = smd 0.4 x 1.5: 1 0.885,-1.085; 2 1.535,-1.085; 3 2.185,-1.085; 4 2.835,-1.085; 5 3.485,-1.085; 6 4.135,-1.085; 7 4.785,-1.085; 8 5.435,-1.085; 9 6.085,-1.085; 10 6.735,-1.085; 11 6.735,6.165; 12 6.085,6.165; 13 5.435,6.165; 14 4.785,6.165; 15 4.135,6.165; 16 3.485,6.165; 17 2.835,6.165; 18 2.185,6.165; 19 1.535,6.165; 20 0.885,6.165
10X03MTA = drill 1.016 long: 1 2.54,0; 2 0,0; 3 -2.54,0
10X10MTA = drill 1.016 long: 1 11.43,0; 2 8.89,0; 3 6.35,0; 4 3.81,0; 5 1.27,0; 6 -1.27,0; 7 -3.81,0; 8 -6.35,0; 9 -8.89,0; 10 -11.43,0
10X05MTA = drill 1.016 long: 1 5.08,0; 2 2.54,0; 3 0,0; 4 -2.54,0; 5 -5.08,0
10X02MTA = drill 1.016 long: 1 1.27,0; 2 -1.27,0
10X04MTA = drill 1.016 long: 1 3.81,0; 2 1.27,0; 3 -1.27,0; 4 -3.81,0
JP2 = drill 0.914 long: 1 -2.54,0; 2 0,0; 3 2.54,0
WE-CHSA_1212 = smd 2.1 x 3.7: 1 -5.1,0; 2 5.1,0
LED3MM = drill 0.813 octagon: A -1.27,0; K 1.27,0
FECS43 = drill 1.5 pad 2.54: P$1 0,6.731; P$2 0,-6.731; P$3 -6.731,0
SPEC-3SP = drill 0.8 square: P$1 0,2.032; P$2 0,5.969; P$3 -0.035,9.979; P$4 -0.035,14.024; P$5 -0.035,17.988; P$6 20.101,17.996; P$7 20.101,13.994; P$8 20.101,9.992; P$9 20.128,5.974; P$10 20.101,2.013
TGS26XX = drill 0.65 pad 1.676: P$1 -1.778,1.778; P$2 -1.778,-1.778; P$3 1.778,-1.778; P$4 1.778,1.778
TEMP-HUM-SENSOR-DHT11 = drill 0.8 square: 1 -3.81,0 | drill 0.8: 2 -1.27,0; 3 1.27,0; 4 3.81,0
NODEMCU = drill 1 pad 1.676 long: 1 -13.97,17.78; 2 -13.97,15.24; 3 -13.97,12.7; 4 -13.97,10.16; 5 -13.97,7.62; 6 -13.97,5.08; 7 -13.97,2.54; 8 -13.97,0; 9 -13.97,-2.54; 10 -13.97,-5.08; 11 -13.97,-7.62; 12 -13.97,-10.16; 13 -13.97,-12.7; 14 -13.97,-15.24; 15 -13.97,-17.78; 16 13.97,-17.78; 17 13.97,-15.24; 18 13.97,-12.7; 19 13.97,-10.16; 20 13.97,-7.62; 21 13.97,-5.08; 22 13.97,-2.54; 23 13.97,0; 24 13.97,2.54; 25 13.97,5.08; 26 13.97,7.62; 27 13.97,10.16; 28 13.97,12.7; 29 13.97,15.24; 30 13.97,17.78
GAS-SENSOR-MQ2 = drill 1 square: 1 -14.605,3.81 | drill 1: 2 -14.605,1.27; 3 -14.605,-1.27; 4 -14.605,-3.81 | hole 2.8: -13.589,7.62; -13.589,-7.62; 13.589,-7.62; 13.589,7.62
SOT23 = smd 1 x 1.4: 1 -0.95,-1.1; 2 0.95,-1.1; 3 0,1.1
R0805 = smd 1.3 x 1.5: 1 -0.95,0; 2 0.95,0
B64Y = drill 0.813 long: A 2.54,0; E -2.54,0; S 0,0
R0603 = smd 1 x 1.1: 1 -0.85,0; 2 0.85,0
M0805 = smd 1.3 x 1.6: 1 -0.95,0; 2 0.95,0
TP08R = smd 0.8 x 0.8: TP 0,0
TO92-CLP = drill 0.813 octagon: A 0,1.905; C 1.27,0; R -1.27,0
AK500/2 = drill 1.321 long: 1 -2.515,0; 2 2.515,0

### Placement (x,y rotation side)
C1  105.41,72.64 180 top
C2  102.36,89.92 270 top
C3  58.04,70.99 270 top
C4  58.29,76.96 0 top
C5  84.71,74.55 90 top
C6  77.22,63.63 270 top
C7  31.62,84.2 90 top
C8  34.67,69.47 270 top
C9  30.48,70.23 90 top
C10  39.75,71.12 0 top
C11  37.34,84.2 90 top
C12  36.96,28.96 270 top
C13  38.48,28.96 270 top
C14  41.27,30.35 0 top
C15  30.61,29.59 90 top
C16  27.81,25.65 180 top
C17  94.11,16 90 top
C18  37.85,42.16 90 top
C19  40.89,41.02 0 top
C20  30.35,42.04 270 top
C21  29.21,46.1 180 top
C22  13.46,93.73 90 top
C23  66.55,41.78 270 top
C24  74.42,41.78 270 top
C25  64.52,42.42 270 top
C26  72.39,42.42 90 top
C27  62.23,15.75 0 top
C28  90.93,7.37 90 top
C29  85.6,18.29 180 top
D1  67.18,8.38 180 top
G1  68.2,90.55 180 top
IC1  62.74,69.22 0 top
IC2  76.58,69.85 180 top
IC4  36.58,35.69 0 top
IC5  73.28,22.86 0 top
IC6  17.53,93.6 90 top
IC7  73.28,51.56 180 top
IC8  34.54,76.33 0 top
J1  114.3,7.11 0 top
J2  135.64,37.97 90 top
J3  135.64,18.92 90 top
J4  95.12,48.13 90 top
J5  135.64,57.15 90 top
JP1  32,65.28 180 top
JP2  33.91,25.53 180 top
JP3  39.24,13.97 180 top
JP5  35.31,46.1 180 top
JP6  35.18,55.88 0 top
L1  78.34,8.51 0 top
LED1  92.71,20.45 0 top
M1  11.94,78.87 0 top
M2  2.29,18.16 0 top
M3  2.29,43.94 0 top
M4  14.86,7.49 180 top
M5  30.23,7.49 180 top
M6  127.76,68.45 90 top
M8  114.3,31.62 0 top
M9  113.92,87.38 0 top
Q1  25.78,75.69 270 top
Q2  88.14,42.16 0 top
Q3  89.03,49.91 0 top
R1  51.82,70.99 90 top
R2  57.28,62.1 180 top
R3  68.71,62.99 270 top
R4  63.37,62.1 0 top
R5  57.78,64.9 0 top
R6  75.06,77.47 90 top
R7  62.99,76.45 90 top
R8  65.79,76.45 90 top
R9  58.17,81.03 0 top
R10  80.9,74.93 90 top
R11  70.48,69.85 90 top
R12  78.11,77.47 90 top
R13  27.81,69.34 0 top
R14  26.67,84.2 90 top
R15  29.34,84.2 270 top
R16  29.08,89.15 0 top
R17  38.86,68.45 90 top
R18  36.58,69.47 90 top
R19  42.93,68.45 90 top
R20  40.89,68.45 270 top
R21  44.96,68.45 270 top
R22  27.69,78.61 0 top
R23  39.24,84.2 90 top
R24  35.43,84.2 270 top
R25  28.07,15.24 0 top
R26  34.8,20.19 270 top
R27  27.56,28.57 180 top
R28  32.51,29.59 270 top
R29  27.18,43.18 180 top
R30  32.77,42.04 90 top
R31  41.78,46.1 0 top
R32  42.8,55.88 180 top
R33  37.72,51.05 270 top
R34  43.69,50.16 180 top
R35  27.56,55.88 0 top
R36  34.29,51.05 270 top
R37  22.23,6.86 90 top
R38  37.72,6.86 90 top
R39  40.01,24.64 0 top
R40  46.35,14.61 270 top
R41  38.1,20.19 270 top
R42  43.69,19.18 180 top
R43  28.7,19.18 0 top
R44  28.7,50.16 0 top
R45  88.27,38.73 180 top
R46  85.34,44.45 90 top
R47  89.15,46.48 180 top
R48  85.47,50.16 270 top
R49  87.25,20.83 180 top
R50  89.03,16.13 270 top
R51  82.55,19.18 90 top
R52  133.35,64.77 90 top
R53  91.82,16 270 top
TP3  39.62,79.12 0 top
TP7  63.37,64.39 0 top
TP8  71.75,57.4 0 top
TP9  54.48,62.1 0 top
TP10  63.63,56.52 0 top
TP12  61.85,51.31 0 top
TP16  60.83,52.32 0 top
TP17  73.03,56.26 0 top
TP18  69.6,57.28 0 top
TP19  64.64,51.69 0 top
TP20  63.12,52.2 0 top
VR1  51.82,66.04 270 top
X1  56.9,6.22 180 top

### Tracks (layer width: path | path; a pad name or v marks a point on that pad's centre or on a via)
0.7V
  Top 0.305: IC8.10 35.81,81.03 37.34,82.42 C11.1 | C11.1 37.39,83.25 | 37.39,83.25 37.16,83.25 | 37.16,83.25 R24.2 | C11.1 37.16,83.25 | 37.39,83.25 R23.1
0.7VREF  (via drill 0.5)
  Top 0.152: 37.72,80.52 37.72,77.22 35.18,77.22 35.18,81.41 34.16,82.42 34.16,84.2 40.51,84.2 40.51,81.66 40.26,81.41 37.72,81.41 37.72,80.52
  Top 0.305: IC8.9 37.08,80.52 37.72,80.52 38.48,80.52 38.48,79.05 IC8.8
  Top 0.406: 38.48,79.05 38.55,79.12 TP3.TP
  Bottom 0.406: JP1.3 29.46,62.74 30.73,61.47 41.53,61.47 44.96,64.64 46.74,66.17 46.74,73.66 41.27,79.12 TP3.TP
  other vias: 39.62,79.12
1VREF  (via drill 0.5)
  Top 0.152: 31.37,80.9 31.37,77.22 33.91,77.22 33.91,80.9 32.64,82.17 32.64,84.2 25.53,84.2 25.53,81.92 31.37,81.92 31.37,80.9
  Top 0.406: v40.51,64.26 40.51,62.87 39.62,61.98 27.81,61.98 v26.67,63.12 | IC8.14 v30.73,80.9 31.37,80.9 32,80.9 IC8.13 | R18.1 36.58,65.28 JP1.1
  Bottom 0.406: v26.67,63.12 26.67,76.83 v30.73,80.9 | v40.51,64.26 39.88,65.28 JP1.1
1VREF_CO
  Top 0.406: R4.S TP7.TP IC1.3
2.5VREF  (via drill 0.5)
  Top 0.406: R1.1 VR1.C VR1.R 51.82,62.74 52.45,62.1 TP9.TP R2.2
  Top 0.508: v52.7,58.29 52.7,61.85 52.45,62.1 | v46.99,27.43 v46.99,31.11
  Bottom 0.508: JP6.3 37.72,56.9 39.12,58.29 v52.7,58.29 52.7,56.77 50.8,54.86 50.8,38.86 48.39,36.45 48.39,32.51 v46.99,31.11 | JP3.3 36.7,15.11 37.72,16.13 46.99,16.13 48.26,17.4 48.26,25.53 46.99,26.8 v46.99,27.43
!CS  (via drill 0.6)
  Top 0.305: IC7.18 71.09,47.09 71.88,47.75 75.69,47.75 82.04,41.4 82.8,41.4 v83.44,40.77
  Bottom 0.305: v83.44,40.77 83.31,40.77 83.57,40.51 83.57,38.61 86.23,35.81 96.01,35.81 97.79,34.16 M8.7
!SHDN  (via drill 0.6)
  Top 0.305: IC7.10 66.55,50.42 66.55,49.91 v66.8,49.66
  Bottom 0.305: v66.8,49.66 67.06,49.66 79.88,49.66 80.01,49.78 83.06,49.78 91.06,41.78 M8.4
AMM_OUT
  Top 0.305: 50.8,37.72 64.77,51.69 64.77,52.83 65.91,53.98 67.56,53.98 67.84,53.7 IC7.8
  Top 0.406: 49.28,11.43 49.28,36.2 50.8,37.72 | TP19.TP 64.77,51.69
  Top 0.508: M5.P$2 36.51,9.27 R38.2 37.53,7.81 38.99,9.14 46.99,9.14 49.28,11.43
CO_OUT
  Top 0.305: IC7.2 71.74,57.92 TP8.TP
  Top 0.406: C5.+ 81.6,73.28 R10.1 81.03,73.85 81.03,69.09 76.45,69.09 75.95,68.45 IC2.6 75.95,65.15 71.75,60.83 TP8.TP
DHT
  Top 0.406: J2.3 133.86,44.32 132.72,45.47 132.72,61.34 135,63.63 135,65.02 134.53,65.62 R52.2 131.15,67.18 M6.2
  Bottom 0.508: M8.28 J2.3
DOUT
  Top 0.305: 71.12,49.4 69.6,49.4 69.14,48.95 IC7.15
  Top 0.406: Q2.3 88.01,43.31 87.67,43.65 85.39,43.65 R46.1 82.38,43.6 76.58,49.4 71.12,49.4
GND  (via drill 0.5, 0.6)
  Top 0.305: 68.07,43.43 67.84,43.71 IC7.13 67.84,50.27 67.19,50.92 IC7.9 | IC7.14 68.49,43.73 68.2,43.43 | 33.34,85.15 31.68,85.15 C7.2 31.55,85.02 C7.2
  Top 0.406: M8.2 J4.2 | IC4.11 36.58,42.55 37.08,43.05 C18.2 38.75,43.94 v38.86,43.94 | R36.1 36.07,52 R33.1 | C8.2 v34.67,67.44 | C13.2 38.49,28.07 39.12,28.07 39.62,27.56 v39.62,27.43 | v36.45,22.61 36.45,21.14 | C11.2 37.29,85.15 R24.1 33.34,85.15 33.27,84.58 33.27,82.42 34.54,81.15 IC8.11 | C7.2 v31.62,86.49 R16.A 31.62,92.2 29.21,94.61 IC6.3 17.51,94.6 C22.2 | C2.2 102.23,88.91 102.23,88.65 | VR1.A 53.72,69.09 54.75,70.12 C3.2 58.18,69.98 64.64,69.98 | R3.1 68.52,63.94 67.44,65.02 v66.29,65.02 65.15,65.02 64.64,65.41 IC1.4 64.64,69.98 | 64.64,69.98 v67.56,69.98 | v67.56,69.98 70.36,69.98 R11.S | IC2.4 74.68,73.91 74.04,74.55 68.45,74.55 67.56,73.66 v67.56,69.98 | 81.13,20.3 81.31,20.3 | 68.07,43.43 68.2,43.43 | v73.28,20.45 v73.28,19.05 | 74.04,19.68 72.9,19.68 72.77,19.81
  Top 0.508: R51.2 81.83,20.03 81.31,20.3 | C17.2 94.11,20.19 LED1.K | 68.07,43.43 68.07,40.39 | 68.07,40.39 67.94,40.26 67.92,40.28 C23.- 66.52,40.26 64.52,40.26 C25.2 | C26.1 72.39,40.26 | 72.39,40.26 74.4,40.26 C24.- | 72.39,40.26 68.2,40.26 68.07,40.39 | R41.1 36.45,21.14 R26.1 | C12.2 C13.2 | 36.07,52 v36.07,53.47 | C21.2 v26.92,46.1 | C16.2 26.81,25.53 v25.65,25.53 | C6.2 77.36,62.61 v78.61,62.61
  Top 0.61: 36.45,21.14 36.45,22.73 | 36.45,22.73 v34.42,22.73 34.29,22.73 | 36.45,22.73 v38.48,22.73 38.73,22.73 | v34.16,53.47 v36.07,53.47 v37.72,53.47 | v38.86,43.94 39.24,44.32 v40.01,44.32 v41.15,44.32 | v26.92,46.1 v25.65,46.1 v24.38,46.1 24.38,46.61 v25.02,47.24 v26.29,47.24 | v25.65,26.8 v25.65,25.53 v25.65,24.13 v25.65,22.86 | v39.62,27.43 v39.62,26.42 | v39.62,26.42 39.5,26.54 v38.61,26.54 38.61,27.94 39.62,26.92 v39.62,26.42 | v39.62,26.42 38.99,27.05 38.99,26.92 38.73,26.67
  Top 0.813: v68.33,32.64 68.96,33.27 71.63,33.27 72.39,32.51 72.39,40.26 | v61.72,30.61 63.37,32.51 65.79,32.51 66.55,33.27 66.55,40.26 | 73.15,17.78 73.15,18.67 71.5,20.32 73.28,20.32 73.41,20.45 74.55,20.45 74.68,20.32 74.04,19.68 73.28,18.92 | 73.28,18.92 73.28,17.53 | 73.28,18.92 v73.28,19.05 | 73.28,19.68 v73.28,20.45 72.77,19.94 72.77,19.81 73.66,19.81 73.28,19.43 73.28,19.3
  Top 1.016: IC5.3 73.28,17.53 v73.28,19.05 73.28,19.3 73.28,19.68 73.28,20.32 74.68,20.32 76.83,20.32 81.13,20.3 | 76.71,17.14 77.85,16 v81.53,16.13 v84.84,16 81.53,16.76 81.41,16.89 78.23,16.89 77.6,17.53 76.83,17.53 | M8.10 103.25,26.54 104.01,27.3 104.01,46.86 | 104.01,46.86 104.01,52.83 103,53.85 103,53.98 102.87,53.98 C1.- 103.38,72.64 105.03,74.3 105.03,86.49 102.87,88.65 102.23,88.65 M9.2 | M8.2 104.01,46.86 | M5.P$1 32,2.54 29.34,2.41 | R37.1 22.1,5.78 22.1,2.41 | R38.1 37.72,2.41 | 55.5,24.38 v58.8,24.38 | v55.24,30.73 58.67,30.73 v58.8,30.61 | v61.98,33.27 61.98,36.07 v61.72,36.32 | v83.19,22.23 83.69,22.73 v86.49,22.73 | 58.8,33.4 58.8,36.07 58.42,36.45 | 55.24,27.69 58.93,27.69 | 77.34,32.89 77.34,35.94 77.09,36.2
  Top 1.27: M4.P$1 16.76,5.59 16.76,2.41 22.1,2.41 29.34,2.41 37.72,2.41 59.31,2.41 v59.69,2.03
  Top 2.54: X1.1 59.41,8.26 | 59.41,8.26 59.41,15.32 C27.- | D1.A 59.54,8.38 59.41,8.26
  Bottom 0.406: v36.45,22.61 38.73,22.61 40.26,24.13 40.26,27.05 39.88,27.43 v39.62,27.43 | J5.1 133.22,60.96
  Bottom 0.508: M8.24 J2.7
  Bottom 1.016: 105.41,16.38 M8.14 95.38,16.38 94.61,15.62 v94.61,5.08 | 105.41,16.38 112.14,16.38 116.84,11.68 J1.1 | M8.10 104.27,26.54 105.41,25.4 105.41,16.38
  Bottom 2.54: X1.1 59.44,6.2 59.44,3.17 59.82,2.79 87.88,2.79 v87.88,3.43 87.88,4.57 88.14,4.83 94.61,4.83 94.61,2.41 87.88,2.41
  other vias: 87.88,4.95 86.11,2.03 94.61,3.56 94.61,1.91 58.8,27.56 61.85,24.38 61.85,27.56 64.64,30.61 64.64,27.56 64.64,24.38 68.83,24.38 68.71,27.43 73.03,32.77 77.22,32.89 77.47,27.18 77.6,24.38 83.19,24.64 83.06,27.56 83.06,30.35 78.61,16.13 73.28,21.84 87.88,2.03 58.17,12.32 61.98,12.19 65.91,12.19 58.17,8.89 62.1,8.89 67.56,4.57 67.31,2.03 71.12,2.16 51.82,30.61 55.37,27.69 51.82,27.56 55.37,24.26 51.94,24.26 58.55,36.32 65.02,36.32 68.45,36.32 72.52,36.32 77.09,36.32 89.28,31.24 89.41,28.32 95.25,26.54 97.54,25.53 89.53,26.16 55.24,36.45 51.56,34.42 55.24,34.42 58.67,33.27 83.06,33.02 68.71,29.97 73.03,29.97 77.47,29.97 64.26,47.62 64.26,45.21 60.71,45.21 56.52,41.02 60.71,41.15 68.33,40.26 68.33,42.42 70.87,40.13 76.71,40.26 73.28,15.11 64.26,4.83 63.12,2.03 43.18,1.91 37.85,1.91 32.13,1.91 35.31,5.21 40.01,5.33 25.02,5.08 19.81,5.21 27.69,2.03 22.35,1.78 17.02,1.91 12.32,2.03 49.4,2.03 54.23,2.03 45.85,96.77 46.99,96.77 48.13,96.77 49.28,96.77 50.42,96.77 46.23,92.2 47.37,92.2 48.51,92.2 49.66,92.2 50.8,92.2 61.09,83.57 62.23,83.57 63.37,83.57 64.39,83.57 44.2,80.77 79.38,83.69 80.52,83.69 81.66,83.69 82.8,83.69 83.95,83.69 84.07,96.9 85.22,96.9 86.36,96.9 87.5,96.9 88.65,96.9 64.52,91.69 65.66,91.69 66.8,91.69 67.94,91.69 69.09,91.69 88.39,87.5 89.28,88.39 90.17,89.15 91.06,89.92 15.37,95.76 17.27,97.16 24.13,97.16 25.15,94.11 29.59,93.98 34.92,94.11 34.92,97.03 33.27,89.15 20.45,94.87 41.4,96.9 38.23,91.95 38.23,94.74 41.66,93.73 41.4,87.76 42.04,83.95 47.88,80.9 51.44,79.88 55.24,80.01 47.5,84.84 47.37,88.9 51.18,88.9 53.85,86.36 56.26,83.95 51.31,83.95 80.26,79.88 84.71,80.01 90.17,80.14 94.23,80.14 90.17,83.95 96.27,88.9 96.27,93.47 96.52,83.69 96.27,97.03 90.81,96.9 90.81,94.61 92.2,92.71 93.6,88.39 95.5,87.25 96.39,85.47 94.49,82.68 92.33,82.68 90.42,85.47 79.63,91.19 85.6,91.19 82.17,95.12 82.55,87.5 75.44,95 75.31,87.63 72.01,83.44 69.85,87.5 63.75,87.38 57.53,87.25 57.53,90.93 57.4,95 60.2,97.16 63.88,95.12 69.72,95.25 51.56,95 73.66,91.06 106.81,96.39 114.81,96.39 122.81,96.27 123.06,89.92 114.94,89.41 109.35,89.41 103.63,87.25 103.76,82.68 103.63,77.85 110.24,77.98 115.57,77.85 122.81,77.85 118.87,83.57 113.16,82.8 118.24,93.6 124.97,83.44 129.67,83.57 133.35,85.85 133.73,80.01 128.52,90.42 132.08,76.07 110.36,73.15 116.2,73.03 123.19,72.9 123.19,67.44 116.59,67.18 108.97,66.8 107.57,63.63 125.09,61.34 121.79,57.66 107.57,57.78 121.92,53.34 111,51.69 117.98,51.56 110.87,46.23 118.36,46.48 111.25,39.37 118.49,39.5 123.95,35.18 109.6,33.66 115.44,33.66 123.19,29.08 115.95,24.64 109.6,25.02 109.47,18.03 116.08,17.78 124.08,17.53 128.27,8.51 128.27,3.56 121.67,2.03 114.3,2.03 107.57,2.03 100.84,1.91 101.09,9.53 106.55,9.4 114.17,10.16 121.92,9.91 119.51,14.61 119.51,22.1 112.9,29.84 119.13,29.84 114.43,42.8 114.3,49.53 113.16,57.91 117.98,57.91 113.41,63.75 120.4,63.88 113.03,70.1 120.02,69.98 25.65,44.96 24.38,44.96 66.93,47.62 33.27,85.09 65.41,65.02 67.18,65.02 64.64,69.09 65.66,69.98 66.67,69.98 73.79,74.55 72.77,74.55 71.75,74.55 61.72,55.24 57.53,55.24 53.59,55.24 52.2,51.44 52.32,44.83 54.74,47.12 56.9,49.15 59.05,51.56 60.07,53.72 55.75,51.44 52.32,49.02 49.53,45.72 49.53,41.78 45.47,37.59 42.93,38.48 44.96,41.02 47.37,39.62 47.62,43.81 96.52,78.74 93.73,75.82 90.17,72.26 86.61,68.83 83.06,65.66 81.92,60.71 78.11,56.64 74.55,55.5 74.68,51.31 80.01,51.31 85.22,53.09 92.08,52.2 98.42,52.2 102.74,53.72 102.36,60.71 102.49,66.04 99.69,75.69 96.65,72.26 93.09,68.71 99.44,68.58 89.28,65.02 96.52,64.9 88.65,60.45 95.76,60.45 84.71,56.77 92.2,56.77 98.17,56.64
  pour Top: 86.36,4.7 87.76,6.1 94.87,6.1 95.89,5.08 95.89,1.91 94.87,0.89 87.12,0.89 86.36,1.65
  pour Bottom: 58.55,1.27 57.02,2.79 57.02,30.86 59.94,33.91 82.17,33.91 84.07,32 84.07,27.94 89.15,22.86 95.38,22.86 96.39,21.84 96.39,2.41 95.25,1.27
  pour Top: 58.93,1.27 57.15,3.05 57.15,16.76 57.78,17.4 60.58,17.4 61.98,16 61.98,14.35 62.99,13.34 66.04,13.34 67.06,12.32 67.06,6.22 69.22,4.06 70.48,4.06 71.75,2.79 71.75,1.27
  pour Bottom: 26.16,54.23 49.15,54.23 50.55,52.83 50.55,42.8 60.2,33.15 60.2,2.79 58.8,1.4 11.68,1.4 9.53,3.56 9.53,10.29 6.22,13.59 2.03,13.59 2.03,62.99 4.95,65.91 22.86,65.91 26.16,62.61
  pour Bottom (isolate 0.406): 1.78,12.83 1.78,84.96 16.38,97.66 122.94,97.66 134.75,85.85 134.75,55.37 132.84,53.47 132.84,6.1 127.89,1.14 12.57,1.14 9.53,4.19 9.53,9.78 6.48,12.83
  pour Top (isolate 0.406): 50.42,22.48 50.42,36.32 62.48,48.39 67.69,48.39 67.82,48.26 67.82,46.86 65.79,46.86 65.41,46.48 65.41,43.94 66.17,43.18 72.01,43.18 73.15,44.32 73.15,45.85 75.31,45.85 84.07,37.08 84.07,36.96 84.84,36.2 85.98,36.2 93.73,28.45 93.85,28.45 94.36,27.94 100.2,27.94 101.6,26.54 101.6,25.78 101.35,25.53 101.35,1.65 100.46,0.76 11.81,0.76 9.27,3.3 9.27,5.97 12.06,7.49 19.05,7.49 20.57,5.97 25.02,5.97 26.54,7.49 34.67,7.49 36.07,6.1 39.12,6.1 40.26,7.24 46.61,7.24 50.29,10.92 50.29,22.1
  pour Top (isolate 0.406): 16.13,97.79 127.51,97.79 128.78,96.52 128.91,91.95 134.75,86.11 134.62,75.31 99.82,75.31 96.01,79.12 85.09,79.12 84.84,79.38 49.02,79.38 48.13,80.26 42.8,80.26 41.27,81.79 41.27,85.47 40.13,86.61 40.13,88.01 39.75,88.39 32,88.39 29.08,91.31 26.16,91.19 22.99,94.36 12.7,94.36
  pour Top (isolate 0.406): 109.35,75.06 109.35,69.98 107.82,68.45 107.82,65.91 106.81,64.9 106.81,56.77 107.7,55.88 107.7,14.22 104.39,11.3 101.35,11.3 101.35,1.4 101.09,1.14 129.29,1.14 131.44,3.3 131.44,11.81 130.68,12.57 125.48,12.57 125.48,37.21 122.17,40.51 122.05,40.51 122.05,51.94 126.36,56.26 126.36,61.59 125.98,61.98 125.98,75.31
  pour Top (isolate 0.406): 27.69,45.72 26.67,44.7 24.38,44.7 24.26,44.83 24.26,47.12 24.64,47.5 26.67,47.5 27.43,47.5 27.56,47.37 27.69,47.24
  pour Top: 45.34,36.83 44.2,37.97 42.16,37.97 42.16,39.12 48.13,45.09 50.16,47.12 50.16,55.24 50.8,55.88 62.74,55.88 62.87,55.75 62.87,55.37 60.45,52.96 60.07,52.58 60.07,51.69 60.07,51.44 45.47,36.83
  pour Top: 74.04,50.8 74.04,57.66 95.63,79.25 98.81,79.25 103.5,74.55 103.5,52.07 103,51.56 90.93,51.56 90.04,52.45 82.42,52.45 80.52,50.55 74.3,50.55
H2S_OUT  (via drill 0.6)
  Top 0.305: 32.77,30.67 IC4.1 31.56,33.09 v30.99,33.02 | C15.2 32.69,30.47 | IC7.6 69.14,54.43 68.33,55.24 64.77,55.24 61.85,52.32 61.85,51.18 45.85,35.18 44.32,35.18 v44.07,34.92
  Top 0.406: 32.77,30.67 R28.1 32.69,30.47 | TP12.TP 61.85,51.18
  Bottom 0.305: v30.99,33.02 30.99,34.16 31.75,34.92 v44.07,34.92
JFET_IN  (via drill 0.5)
  Top 0.305: R22.2 28.57,78.11 28.57,77.6 29.84,76.33 46.48,76.33 48.9,73.91 v48.9,73.66
  Bottom 0.406: M8.29 125.6,46.86 124.97,47.5 124.97,57.66 120.52,62.1 81.41,62.1 77.22,57.91 54.74,57.91 53.21,59.44 50.55,59.44 48.9,61.09 v48.9,73.66
  Bottom 0.508: M8.29 J2.2
LED
  Bottom 0.508: M8.30 J2.1
MET_OUT
  Top 0.305: 49.66,37.85 63.12,51.31 63.12,52.07 65.66,54.61 67.94,54.61 68.49,54.06 IC7.7
  Top 0.406: 48.26,12.06 48.26,36.45 49.66,37.85 | TP20.TP 63.12,52.07
  Top 0.508: M4.P$2 20.76,9.27 R37.2 24.06,7.81 27.69,11.43 33.53,11.43 34.67,10.29 46.48,10.29 48.26,12.06
MISO
  Top 0.406: M8.8 93.47,31.62 89.28,35.81 89.28,36.83 89.24,38.61 R45.1 89.09,40.1 Q2.2
MOSI  (via drill 0.6)
  Top 0.305: 71.63,48.51 70.44,47.46 IC7.17
  Top 0.406: 71.63,48.51 76.2,48.51 82.17,42.55 83.31,42.55 84.71,41.15 v84.71,39.24
  Bottom 0.406: M8.6 87.25,36.7 v84.71,39.24
N$1  (via drill 0.5)
  Top 0.152: 61.47,64.9 61.47,68.33 64.01,68.33 64.01,65.02 64.64,64.39 64.64,60.45 64.52,60.33 62.48,60.33 62.1,60.71 62.1,64.9
  Top 0.406: IC1.2 62.1,64.9 61.47,64.9 60.83,64.9 | 60.83,64.9 IC1.1 | 60.83,64.9 59.05,64.9 59.05,64.96 R5.2 58.67,64.96 58.67,66.42 58.8,66.55 v58.8,66.93 | R8.2 v65.79,78.99 65.79,80.9 66.17,81.28 78.11,81.28 | R12.2 78.11,81.28 | G1.+ 93.6,90.68 84.2,81.28 78.11,81.28
  Bottom 0.406: v65.79,78.99 62.74,78.99 61.47,77.72 61.47,70.23 58.8,67.56 v58.8,66.93
N$2
  Top 0.305: IC8.2 32,69.72 31.37,69.34 31.36,69.36 C9.1 28.68,69.36 R13.2
N$3
  Top 0.406: IC1.6 63.37,73.66 62.99,74.04 R7.1
N$4  (via drill 0.35)
  Top 0.406: G1.- 51.69,90.55 59.18,83.06 59.12,82.99 R9.2 59.12,77.41 C4.- 60.01,77.4 R7.2 | R5.1 56.77,64.96 v56.77,67.18
  Bottom 0.406: C4.- 59.56,69.98 v56.77,67.18
N$5
  Top 0.305: M3.P$5 4.06,63.74 4.06,63.88 18.16,63.88 21.84,60.2 43.43,60.2 47.88,55.75 47.88,47.24 42.93,42.29 40.64,42.29 40.01,41.66 40.02,41.64 C19.1
  Top 0.406: IC4.9 39.12,39.86 C19.1
N$6
  Top 0.406: IC1.5 64.64,73.34 64.71,73.47 65.79,74.55 R8.1
N$7  (via drill 0.5)
  Top 0.406: v25.27,69.34 R13.1 | Q1.1 24.68,78.95 v24.64,78.99
  Bottom 0.406: v25.27,69.34 25.27,71.12 24.64,71.88 v24.64,78.99 24.64,80.14 19.18,85.6 M1.P$1
N$8  (via drill 0.5)
  Top 0.305: IC8.1 30.73,71.23 C9.2
  Top 0.406: v23.88,71.12 23.89,71.11 C9.2
  Bottom 0.406: M1.P$2 18.41,72.14 19.43,71.12 v23.88,71.12
N$9
  Top 0.406: R4.E R2.1
N$10
  Top 0.406: R4.A 65.97,62.04 R3.2
N$11
  Top 0.406: R15.1 29.34,88.9 R16.S R16.E
N$13  (via drill 0.5)
  Top 0.406: R9.1 57.02,80.83 C4.+ 57.15,76.83 57.15,75.44 57.91,74.68 60.96,74.68 62.1,73.53 IC1.7 | v73.03,78.36 73.53,78.36 73.59,78.42 R6.2
  Bottom 0.406: C4.+ 57.02,78.49 58.93,80.39 72.26,80.39 73.03,79.63 v73.03,78.36
N$14
  Top 0.406: IC2.3 75.95,74.55 75.06,75.44 R6.1
N$15
  Top 0.152: 77.85,74.93 77.85,70.74 75.31,70.74 75.31,74.17 73.66,75.82 73.66,77.47 85.85,77.47 85.98,77.34 85.98,74.55 83.06,74.55 82.68,74.93 77.85,74.93
  Top 0.406: IC2.2 77.22,74.68 77.47,74.93 77.85,74.93 78.11,74.93 R12.1 80.89,76.52 R10.2 84.65,75.88 C5.-
N$16
  Top 0.305: R20.2 R19.1
N$17
  Top 0.305: R14.1 R15.2 31.55,83.25 C7.1 31.62,82.42 33.27,80.77 IC8.12
N$18
  Top 0.305: IC2.5 70.55,67.25 R11.E
N$19
  Top 0.305: R11.A 71.63,72.39 73.91,70.1 78.23,70.1 78.49,70.36 IC2.1
N$20
  Top 0.152: 33.27,72.01 33.4,71.88 33.91,71.88 | 33.91,71.88 33.91,75.44 33.78,75.56 31.5,75.56 31.37,75.44 31.37,70.23 27.81,70.23 27.81,68.33 30.73,68.33 30.73,63.5 33.27,63.5 33.27,70.87 33.91,71.5 33.91,71.88
  Top 0.305: JP1.2 32,68.33 32.77,69.09 32.77,71.25 33.27,71.75 33.27,72.01 IC8.3
N$21
  Top 0.305: IC8.6 37.08,72.26 38.23,71.12 C10.1 38.88,69.32 R17.2 R20.1
N$22
  Top 0.152: 35.81,72.14 35.18,72.14 | 35.18,72.14 35.18,75.44 35.31,75.56 37.59,75.56 37.72,75.44 37.72,72.52 38.23,72.01 39.75,72.01 39.75,70.23 41.91,70.23 41.91,68.45 43.94,68.45 43.94,66.67 39.88,66.67 39.88,68.45 37.85,68.45 37.85,69.47 35.56,69.47 35.56,71.63 35.18,72.14
  Top 0.305: IC8.5 35.81,72.14 36.58,71.37 R18.2
N$23  (via drill 0.5)
  Top 0.406: R17.1 38.86,63.5 38.23,62.87 28.96,62.87 22.61,69.22 v22.61,73.03 22.65,73.07 22.65,73.58 23.88,74.8 Q1.2
  Bottom 0.406: M1.P$3 14.35,78.87 20.19,73.03 v22.61,73.03
N$24
  Top 0.305: C14.1 39.75,30.35 39.12,30.99 IC4.6 39.12,34.8 38.73,35.18 28.32,35.18 27.94,34.8 21.59,34.8 18.41,37.97 4.08,37.97 M2.P$5
N$25
  Top 0.305: C14.2 42.15,31.1 42.16,31.11 41.91,31.37 40.64,31.37 40.39,31.62 IC4.7 40.39,35.31 39.75,35.94 28.19,35.94 27.98,36.16 M2.P$6
N$26
  Top 0.305: IC8.7 38.35,72.9 38.73,72.64 40.13,72.64 40.64,72.01 40.63,72 C10.2 40.75,70.99 42.55,70.99 42.93,70.61 R19.2 R21.1
N$27
  Top 0.305: Q1.3 26.88,78.57 R22.1
N$28
  Top 0.305: IC4.5 37.85,31.24 38.48,30.61 C13.1 38.47,29.72 39.12,29.72 40.95,27.88 R39.2
  Top 0.508: R42.S 43.69,23.88 42.93,24.64 R39.2
N$29
  Top 0.406: M2.P$1 4.83,17.65 23.37,17.65 24.38,18.67 24.38,27.81 25.15,28.57 R27.2
N$30
  Top 0.305: 30.81,28.64 R28.2 33.59,28.64 34.42,29.46 34.42,31.5 34.04,32 IC4.2 | R27.1 30.73,28.57
  Top 0.406: 30.81,28.64 C15.1 30.72,28.7 30.73,28.57
N$31
  Top 0.305: M3.P$6 23.66,61.94 24.51,61.09 43.94,61.09 48.64,56.13 48.64,46.86 42.81,40.9 41.77,40.9
  Top 0.406: IC4.8 40.39,39.26 40.53,39.38 41.78,40.64 41.77,40.9 C19.2
N$32
  Top 0.406: IC4.10 37.85,40.89 37.97,41.15 38.1,41.52 C18.1 38.37,41.29 38.48,41.4 38.48,41.66 40.01,43.18 42.04,43.18 42.67,43.69 42.67,44.2 42.73,44.26 R31.2 42.8,46.17 42.8,47.75 43.69,48.64 R34.S
N$33
  Top 0.508: R43.S 28.7,25.53 | C16.1 28.7,25.53 | JP2.3 28.7,25.53
N$34
  Top 0.406: M3.P$1 5.08,43.18 R29.2
N$35
  Top 0.305: R29.1 28.14,42.91 C20.1 32.69,42.91 R30.2 33.59,42.99 34.04,42.93 34.54,42.55 34.54,40.01 34.04,39.5 IC4.13
N$36
  Top 0.406: JP5.3 C21.1 30.09,47.26 29.72,47.62 28.96,48.26 28.7,48.51 R44.S
N$37
  Top 0.152: 32.64,27.43 27.56,27.43 27.56,29.59 33.66,29.59 33.78,29.72 33.78,31.24 33.4,31.62 33.4,34.54 35.94,34.54 35.94,31.24 35.94,30.61 | 35.94,30.61 35.93,30.61 35.91,30.59 35.91,28.42 35.18,27.69
  Top 0.2: 35.94,31.24 35.31,31.24 | 32.64,27.43 32.64,23.62 35.18,23.62 35.18,27.69
  Top 0.305: JP2.2 33.91,27.43 35.31,28.83 35.31,31.24 IC4.3
N$38
  Top 0.508: R43.E 26.16,16.2 R25.1
N$39
  Top 0.508: R26.2 32.19,19.24 R43.A
N$40
  Top 0.508: R39.1 37.34,24.64 JP2.1
N$41
  Top 0.508: R40.1 46.35,19.18 R42.E
N$42
  Top 0.508: R41.2 41.08,19.24 R42.A
N$43
  Top 0.152: 35.31,40.51 35.94,40.51 | 35.94,40.51 35.94,36.83 35.69,36.58 33.53,36.58 33.4,36.7 33.4,39.75 33.91,40.26 33.91,42.04 27.18,42.04 27.18,44.32 34.04,44.32 34.04,48.01 36.58,48.01 36.58,44.2 35.94,43.56 35.94,40.51
  Top 0.305: IC4.12 35.31,40.51 JP5.2
N$46
  Top 0.406: R31.1 JP5.1
N$47
  Top 0.508: R34.E 46.23,53.4 R32.1
N$48
  Top 0.406: R33.2 41.09,50.1 R34.A
N$49
  Top 0.508: R44.E 26.16,55.43 R35.1
N$50
  Top 0.406: R44.A 30.67,50.1 R36.2
N$53
  Bottom 0.508: M8.20 J3.1
N$57
  Top 0.406: R53.1 91.82,20.07 LED1.A
N$59
  Top 0.406: R50.1 89.03,19.9 R49.1
N$70
  Bottom 0.508: M8.23 J2.8
N$71
  Bottom 0.508: M8.22 J2.9
N$72
  Bottom 0.508: M8.21 J2.10
N$76
  Bottom 0.508: M8.17 J3.4
N$78
  Top 0.406: M8.1 J4.1
NO2_OUT  (via drill 0.6)
  Top 0.305: C20.2 30.43,41.09 R30.1 IC4.14 32.7,38.35 v30.86,38.35 | IC7.5 69.79,54.79 68.71,55.88 64.39,55.88 TP16.TP 60.83,51.31 60.45,50.93 45.34,35.94 44.45,35.94 v44.07,36.32
  Bottom 0.305: v30.86,38.35 30.86,37.34 31.88,36.32 v44.07,36.32
OUT
  Top 1.016: IC5.2 71.58,14.68 | 71.58,14.68 69.6,12.7 69.6,8.45 D1.C | D1.C 73.11,8.38 L1.1 73.24,10.71 71.75,12.19 71.75,14.5 71.58,14.68 | 71.58,14.68 71.58,13.28 70.36,12.06 70.36,9.78 70.61,10.03 72.52,10.03 72.52,10.54 70.99,12.06 70.99,10.92 71.5,10.92 71.75,10.67 71.88,10.67 71.88,12.06 70.87,13.08 | D1.C 70.23,7.68 70.23,6.48 73.03,6.48 73.28,6.73 | 73.28,7.24 73.28,6.73 | 73.28,6.73 73.28,6.48 72.52,5.71 70.1,5.71 69.6,6.22 69.6,8.32 D1.C
OZONE_OUT
  Top 0.305: IC7.1 72.39,55.63 TP17.TP
  Top 0.406: TP17.TP 73.15,56.26 77.47,60.58 78.87,61.09 81.28,63.5 81.53,65.91 M9.4
RX
  Bottom 0.508: M8.19 J3.2
SCK
  Top 0.305: IC7.19 71.74,46.73 72.01,46.99 72.14,46.99
  Top 0.406: M8.9 94.36,29.08 86.36,37.08 85.22,37.08 75.31,46.99 72.14,46.99
SCL  (via drill 0.5)
  Top 0.406: v127.38,53.21 126.49,53.21 124.08,50.8 124.08,42.67 124.97,41.78 M8.27
  Bottom 0.406: J5.4 127.51,53.34 v127.38,53.21
  Bottom 0.508: M8.27 J2.4
SDA  (via drill 0.5)
  Top 0.406: M8.26 124.97,39.24 123.19,41.02 123.19,51.05 127,54.86 v128.27,54.86
  Bottom 0.406: J5.3 134.62,54.86 v128.27,54.86
  Bottom 0.508: M8.26 J2.5
SO2_OUT
  Top 0.305: IC7.4 70.44,55.16 69.09,56.52 TP10.TP 50.29,56.52 44.96,61.85 R21.2
SSTRB  (via drill 0.5, 0.6)
  Top 0.305: IC7.16 69.79,48.2 v70.1,48.51 | R48.1 85.43,51.05 81.79,51.05 80.77,50.04 v80.77,48.77
  Top 0.406: Q3.3 R48.1
  Bottom 0.305: v70.1,48.51 70.48,48.77 v80.77,48.77
STROBE
  Top 0.406: M8.5 95.63,39.24 90,45.38 R47.1 89.98,46.51 Q3.2
TEMP_OUT  (via drill 0.5)
  Top 0.305: v47.75,60.71 47.75,60.45 50.93,57.28 TP18.TP 71.09,55.78 IC7.3
  Top 0.406: IC6.2 v20.32,92.58
  Bottom 0.406: v20.32,92.58 35.31,92.58 39.75,88.14 39.75,82.3 47.75,74.3 v47.75,60.71
TX
  Bottom 0.508: M8.18 J3.3
VCC  (via drill 0.5, 0.6)
  Top 0.305: IC7.11 C23.+ C25.1 | IC7.20 C26.2 74.41,43.29 C24.+ | IC2.7 C6.1
  Top 0.406: R48.2 85.47,47.37 | 85.47,47.37 85.47,45.43 R46.2 | 84.2,47.37 v83.95,47.37 85.47,47.37 | IC4.4 36.58,31.37 v36.83,31.11 36.96,30.99 C12.1 | IC8.4 34.54,71.63 | 34.54,71.63 34.54,70.72 C8.1 | v34.67,71.5 34.54,71.63 | C22.1 16.32,92.85 IC6.1 16.64,92.53 16.64,90.55 17.78,89.41 v23.75,89.41 23.75,86.74 24.51,85.98 25.78,85.98 R14.2 | R23.2 39.24,87.12 38.48,87.63 v34.67,87.63 | C2.1 102.36,90.93 102.11,91.19 | IC1.8 58.09,71.81 C3.1 53.77,71.87 R1.2 45.53,71.94 v45.47,71.88 | C25.1 64.4,43.18 63.12,43.18 v63.12,38.73
  Top 0.508: C24.+ 77.11,43.28 79.25,41.15 v79.25,38.73 | C6.1 77.23,64.52 v79.25,64.52 | 45.53,71.94 46.74,70.73 46.74,64.64 v46.61,64.39 46.61,63.37 47.88,62.1 v50.29,62.1
  Top 0.61: C29.1 87.38,17.39 87.38,16.13 88.23,15.28 R50.2 89.15,15.15 R53.2
  Top 0.813: C17.1 91.85,15.13 R53.2
  Top 1.016: C28.+ 94.31,10.62 94.61,10.92 94.61,13.72 | C17.1 94.61,14.99 | 94.61,14.99 94.61,15.11 | 94.61,14.99 94.61,13.72 | 94.61,13.72 96.52,13.72 | 100.08,13.72 100.2,13.72 M8.15 103.5,13.84 106.43,16.76 106.3,54.86 105.28,56.13 105.28,67.94 107.95,70.61 C1.+ 108.08,72.39 108.08,72.52 108.08,87.5 104.39,91.19 102.11,91.19 M9.1 | 100.2,13.84 100.08,13.72 | 100.08,13.72 96.52,13.72 | 96.52,13.72 96.52,22.35 95.89,23.11 94.61,24.38 88.01,24.38 87,25.4 87,34.04 85.6,35.43 79.38,35.43 v79.25,38.73
  Bottom 0.406: v79.25,38.73 79.38,38.86 81.03,38.86 82.17,40.01 82.17,46.23 83.31,47.37 v83.95,47.37 | JP3.1 41.78,14.99 | v23.75,89.41 23.75,90.68 24.64,91.57 33.53,91.57 34.67,90.42 v34.67,87.63 v34.67,71.5 34.67,68.83 37.21,66.29 45.47,66.29 45.72,66.55 45.72,71.5 45.47,71.75 v45.47,71.88 | 49.4,29.34 40.39,29.34 38.61,31.11 v36.83,31.11
  Bottom 0.508: C1.+ 107.95,69.6 105.16,66.8 105.16,64.14 104.14,63.12 80.64,63.12 | 80.64,63.12 v79.25,64.52 | JP6.1 32.64,59.18 33.91,60.45 41.91,60.33 46.1,64.39 v46.61,64.39 | 80.64,63.12 76.45,58.93 55.12,58.93 53.47,60.58 50.93,60.58 50.29,61.21 v50.29,62.1
  Bottom 0.813: v79.25,38.73 v63.12,38.73 52.45,38.73 49.4,35.69 49.4,29.34 49.4,24.26 49.28,5.46 47.24,3.43 41.78,3.43 | 41.78,3.43 30.99,3.43 | 30.99,3.43 13.97,3.43 13.08,3.94 M4.P$4 M4.P$3 | M5.P$3 M5.P$4 28.45,3.56 30.99,3.43 | JP3.1 41.78,3.43
  Bottom 1.016: M8.15 106.81,13.84 111.76,8.89 J1.3
  pour Top: 82.55,5.97 81.92,6.1 81.53,6.86 81.53,11.18 83.31,12.95 93.22,12.95 93.6,12.57 93.6,9.14 92.84,8.38 87.38,8.38 85.72,6.35 85.34,5.97
VDD  (via drill 0.6)  (2 unrouted)
  Top 0.406: R45.2 87.42,39.75 | 87.42,39.75 87.42,41.22 Q2.1 | Q3.1 88.08,46.71 R47.2 88.3,45.55 91.44,42.42 v91.44,40.13 91.44,35.81 v92.46,34.67 | v86.23,39.75 87.42,39.75 | R52.1 131.19,63.88 | 131.19,63.88 131.15,63.92 131.15,64.64 | M6.1 131.15,64.64 | 131.15,64.64 131.19,64.64 131.19,63.88 | M8.25 130.56,36.7 131.19,37.34 131.19,63.88
  Bottom 0.406: M8.11 95,24 92.46,26.54 v92.46,34.67 | v86.23,39.75 90.93,39.75 v91.44,40.13 | J5.2 128.52,58.42 127.76,59.18 M6.1
  Bottom 0.508: M8.16 J3.5 | M8.25 J2.6
VFBK
  Top 0.406: IC5.4 74.98,18.72 75.18,18.92 78.36,18.92 78.99,18.29 82.13,18.29 R51.1 84.68,18.33 C29.2 84.72,20.08 85.47,20.83 R49.2
VIN
  Top 1.016: 68.45,15.88 69.65,17.07 IC5.1 | IC5.1 68.63,17.07 68.2,16.64 | IC5.1 69.6,16.79 69.6,15.11 68.58,15.11
  Top 2.54: X1.2 53.85,6.76 53.85,18.41 55.75,20.32 63.37,20.32 63.37,18.54 64.64,17.27 64.59,15.8 C27.+ 65.61,15.88 68.45,15.88
VREFIN_1
  Top 0.508: R40.2 46.35,11.94 45.85,11.43 39.24,11.43 | JP3.2 39.24,11.43 | R25.2 31.62,15.24 35.43,11.43 39.24,11.43
VREFIN_2
  Top 0.406: R35.2 28.7,56.07 28.7,57.66 29.59,58.55 35.18,58.55 | R32.2 41.85,57.47 41.91,57.53 40.89,58.55 35.18,58.55 | JP6.2 35.18,58.55
(copper drawn outside any net)
  shapes: Top area x3

### Text on the board
Bottom: ubicuo Tech
tPlace: AIR POLLUTION / MONITORING SYSTEM v1.0 | + | GND